# EAGLE design Watch V2 (EAGLE 9.5.2)
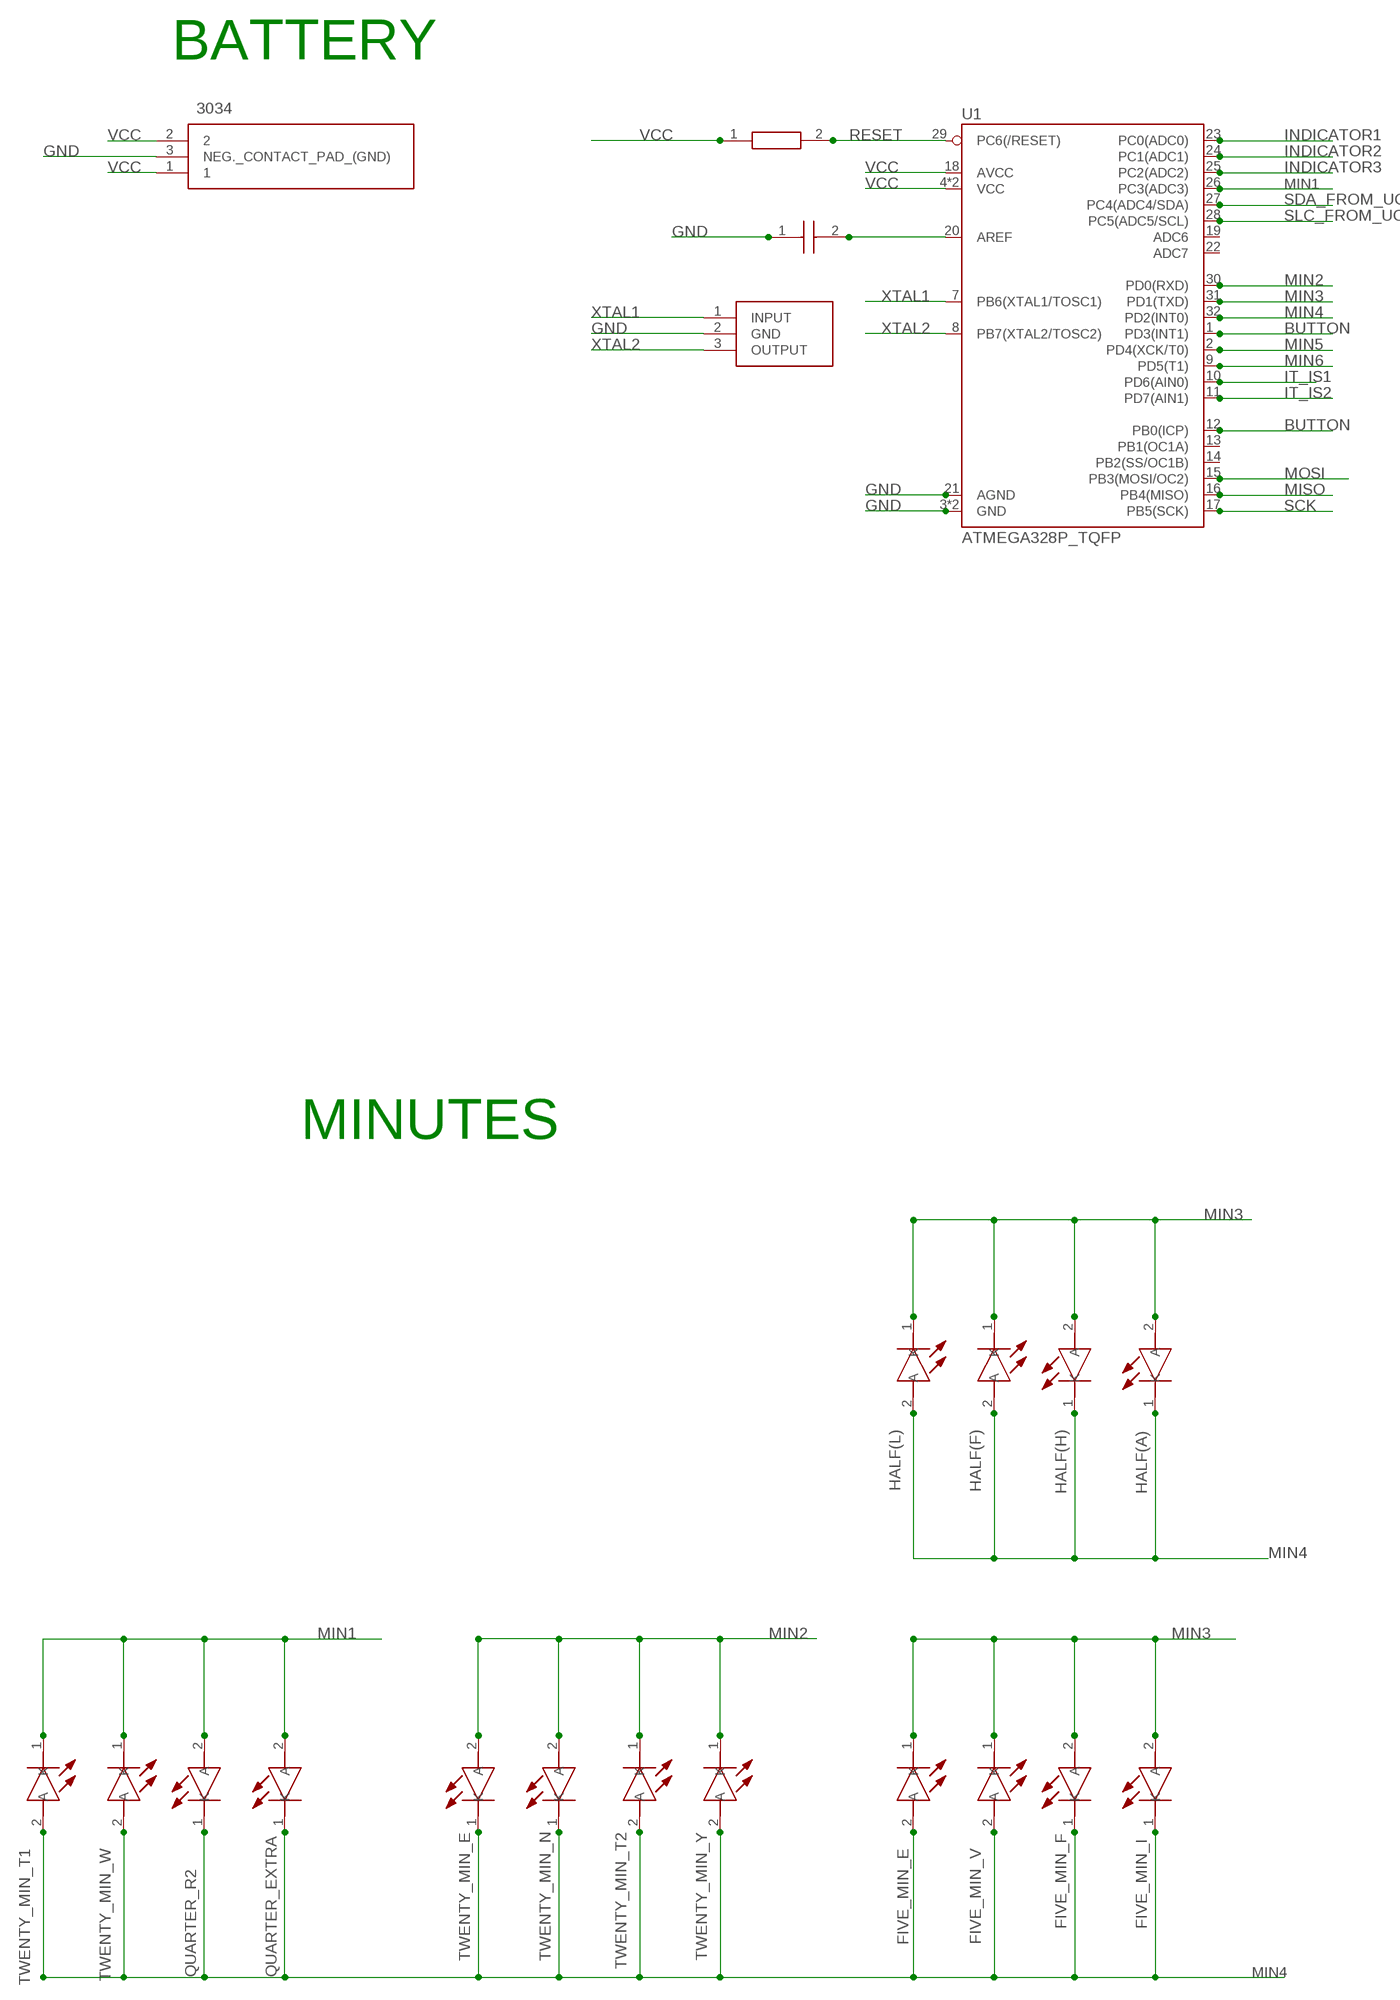
[diagram p0: schematic, sheet 1, part 1 of 3]
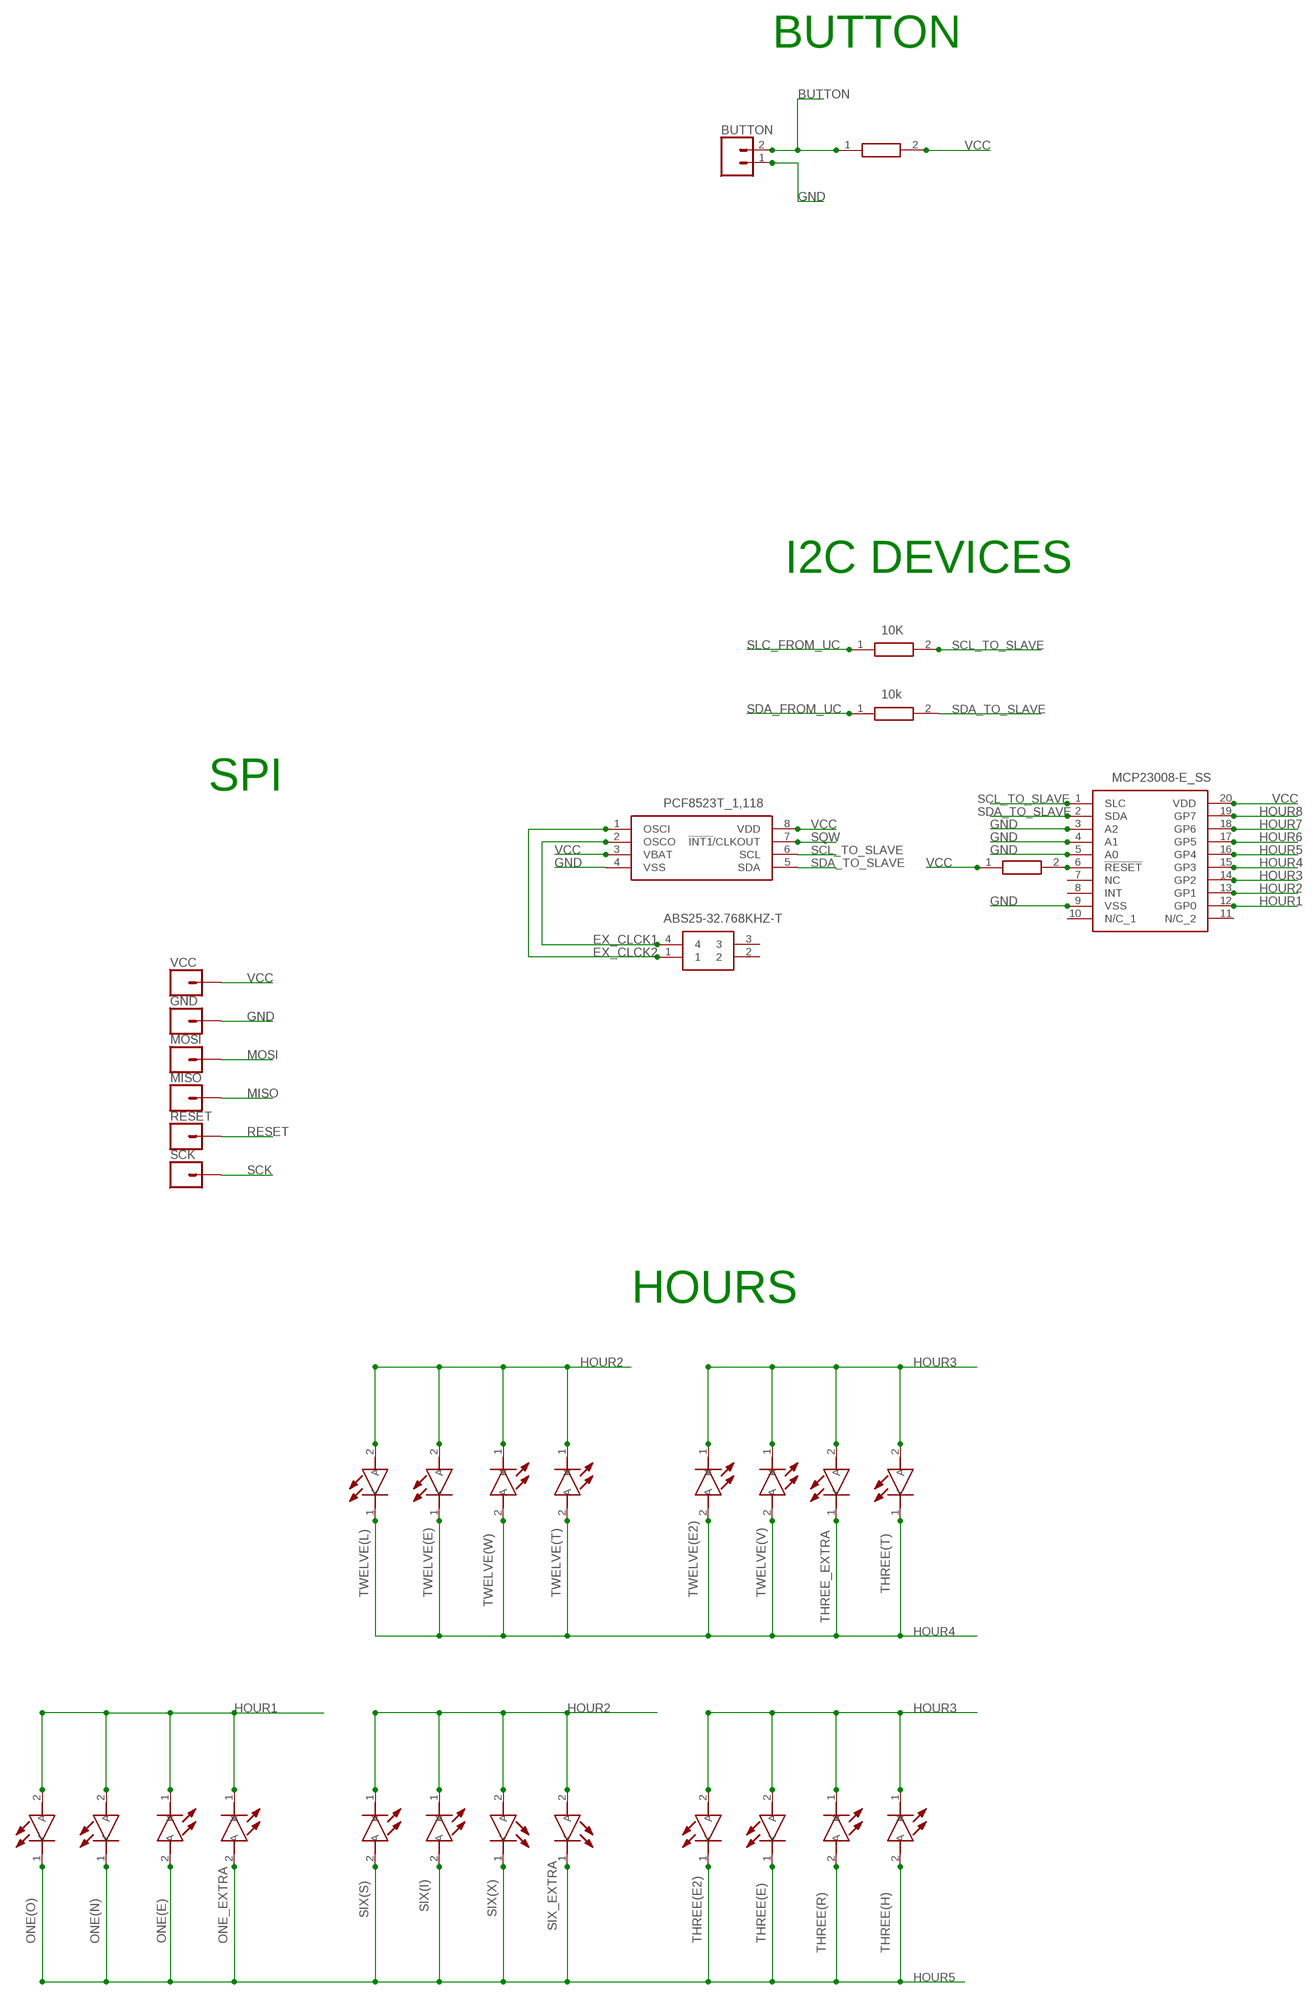
[diagram p1: schematic, sheet 1, part 2 of 3]
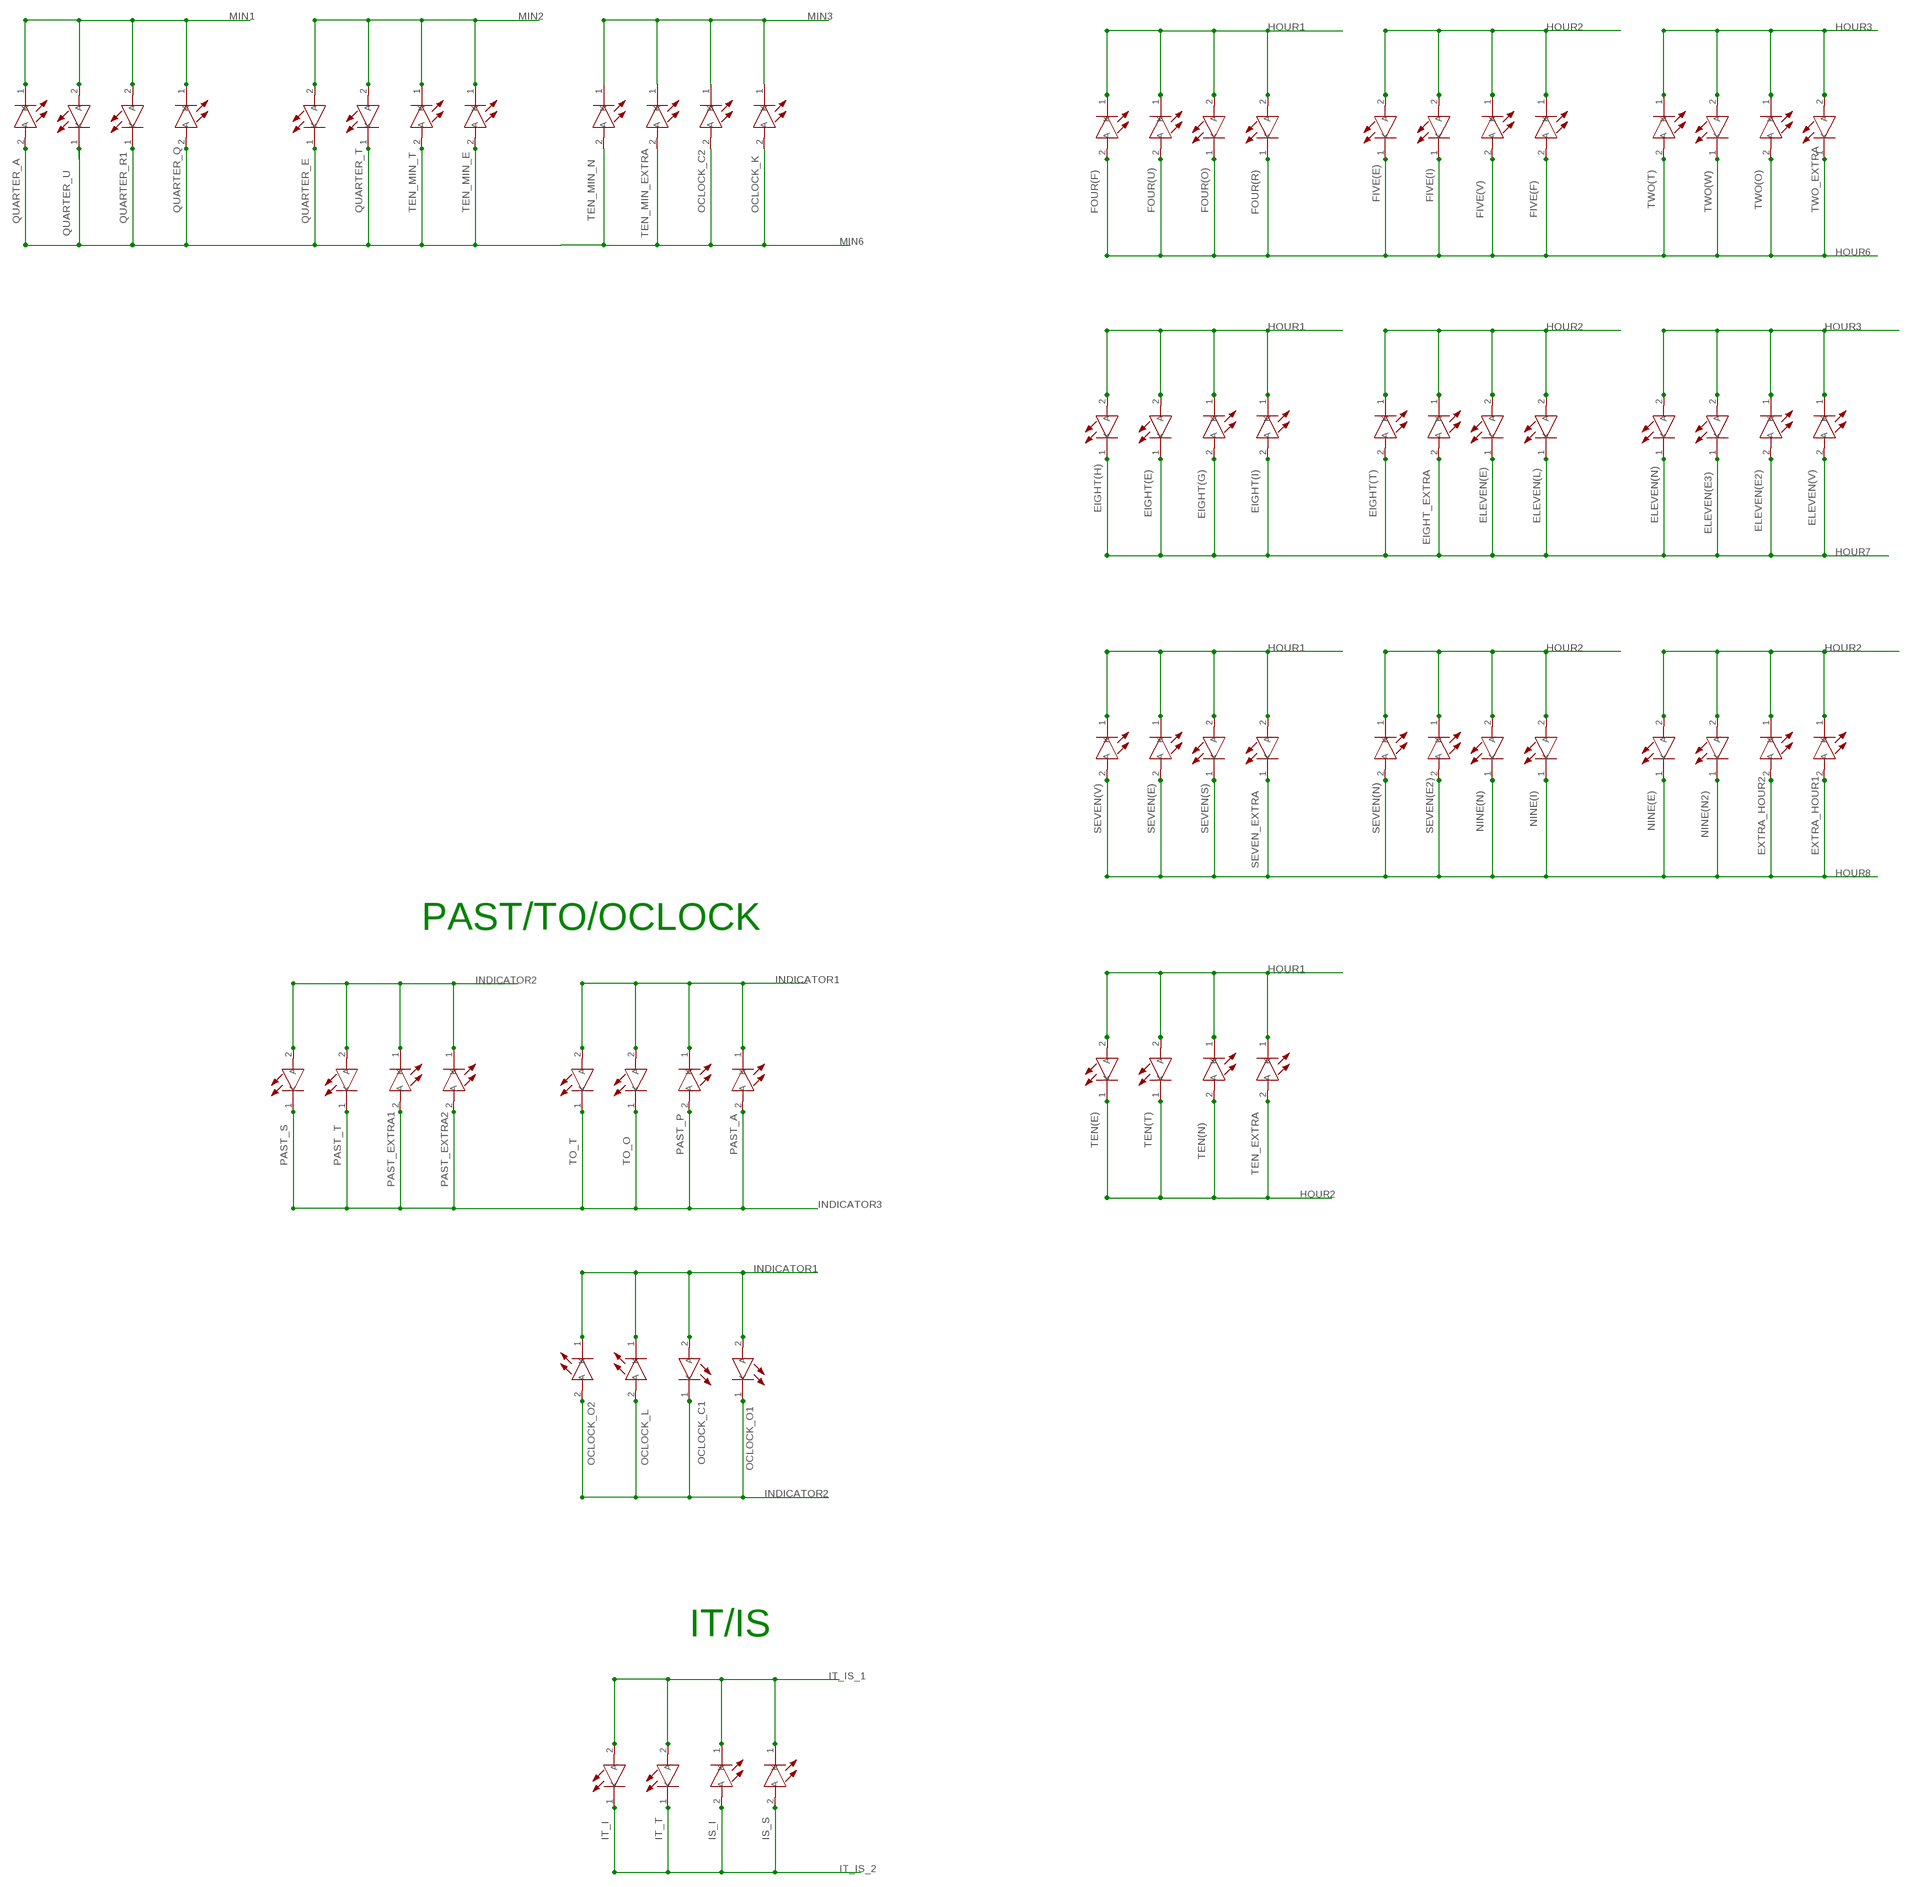
[diagram p2: schematic, sheet 1, part 3 of 3]

## Parts
10K  RC0402FR-0722RL  [RESC1005X40N]
BUTTON  CONN_02  [1X02]
C1  C0402C104Z4VAC  [CAPC1005X55N]
EIGHT(E)  APHHS1005CGCK  [LEDC1005X60N]
EIGHT(G)  APHHS1005CGCK  [LEDC1005X60N]
EIGHT(H)  APHHS1005CGCK  [LEDC1005X60N]
EIGHT(I)  APHHS1005CGCK  [LEDC1005X60N]
EIGHT(T)  APHHS1005CGCK  [LEDC1005X60N]
EIGHT_EXTRA  APHHS1005CGCK  [LEDC1005X60N]
ELEVEN(E2)  APHHS1005CGCK  [LEDC1005X60N]
ELEVEN(E3)  APHHS1005CGCK  [LEDC1005X60N]
ELEVEN(E)  APHHS1005CGCK  [LEDC1005X60N]
ELEVEN(L)  APHHS1005CGCK  [LEDC1005X60N]
ELEVEN(N)  APHHS1005CGCK  [LEDC1005X60N]
ELEVEN(V)  APHHS1005CGCK  [LEDC1005X60N]
EXTRA_HOUR1  APHHS1005CGCK  [LEDC1005X60N]
EXTRA_HOUR2  APHHS1005CGCK  [LEDC1005X60N]
FIVE(E)  APHHS1005CGCK  [LEDC1005X60N]
FIVE(F)  APHHS1005CGCK  [LEDC1005X60N]
FIVE(I)  APHHS1005CGCK  [LEDC1005X60N]
FIVE(V)  APHHS1005CGCK  [LEDC1005X60N]
FIVE_MIN_E  APHHS1005CGCK  [LEDC1005X60N]
FIVE_MIN_F  APHHS1005CGCK  [LEDC1005X60N]
FIVE_MIN_I  APHHS1005CGCK  [LEDC1005X60N]
FIVE_MIN_V  APHHS1005CGCK  [LEDC1005X60N]
FOUR(F)  APHHS1005CGCK  [LEDC1005X60N]
FOUR(O)  APHHS1005CGCK  [LEDC1005X60N]
FOUR(R)  APHHS1005CGCK  [LEDC1005X60N]
FOUR(U)  APHHS1005CGCK  [LEDC1005X60N]
GND  CONN_01  [1X01]
HALF(A)  APHHS1005CGCK  [LEDC1005X60N]
HALF(F)  APHHS1005CGCK  [LEDC1005X60N]
HALF(H)  APHHS1005CGCK  [LEDC1005X60N]
HALF(L)  APHHS1005CGCK  [LEDC1005X60N]
IC1  MCP23008-E_SS  [SOP65P780X200-20N]
IC2  CSTNE16M0VH3C000R0  [CSTNE16M0VH3C000R0]
IC3  PCF8523T_1,118  [SOIC127P600X175-8N]
IS_I  APHHS1005CGCK  [LEDC1005X60N]
IS_S  APHHS1005CGCK  [LEDC1005X60N]
IT_I  APHHS1005CGCK  [LEDC1005X60N]
IT_T  APHHS1005CGCK  [LEDC1005X60N]
MISO  CONN_01  [1X01]
MOSI  CONN_01  [1X01]
NINE(E)  APHHS1005CGCK  [LEDC1005X60N]
NINE(I)  APHHS1005CGCK  [LEDC1005X60N]
NINE(N2)  APHHS1005CGCK  [LEDC1005X60N]
NINE(N)  APHHS1005CGCK  [LEDC1005X60N]
OCLOCK_C1  APHHS1005CGCK  [LEDC1005X60N]
OCLOCK_C2  APHHS1005CGCK  [LEDC1005X60N]
OCLOCK_K  APHHS1005CGCK  [LEDC1005X60N]
OCLOCK_L  APHHS1005CGCK  [LEDC1005X60N]
OCLOCK_O1  APHHS1005CGCK  [LEDC1005X60N]
OCLOCK_O2  APHHS1005CGCK  [LEDC1005X60N]
ONE(E)  APHHS1005CGCK  [LEDC1005X60N]
ONE(N)  APHHS1005CGCK  [LEDC1005X60N]
ONE(O)  APHHS1005CGCK  [LEDC1005X60N]
ONE_EXTRA  APHHS1005CGCK  [LEDC1005X60N]
PAST_A  APHHS1005CGCK  [LEDC1005X60N]
PAST_EXTRA1  48ohm  APHHS1005CGCK  [LEDC1005X60N]
PAST_EXTRA2  APHHS1005CGCK  [LEDC1005X60N]
PAST_P  48ohm  APHHS1005CGCK  [LEDC1005X60N]
PAST_S  APHHS1005CGCK  [LEDC1005X60N]
PAST_T  APHHS1005CGCK  [LEDC1005X60N]
QUARTER_A  APHHS1005CGCK  [LEDC1005X60N]
QUARTER_E  APHHS1005CGCK  [LEDC1005X60N]
QUARTER_EXTRA  APHHS1005CGCK  [LEDC1005X60N]
QUARTER_Q  APHHS1005CGCK  [LEDC1005X60N]
QUARTER_R1  APHHS1005CGCK  [LEDC1005X60N]
QUARTER_R2  APHHS1005CGCK  [LEDC1005X60N]
QUARTER_T  APHHS1005CGCK  [LEDC1005X60N]
QUARTER_U  APHHS1005CGCK  [LEDC1005X60N]
RED1  RC0402FR-0722RL  [RESC1005X40N]
RED2  RC0402FR-0722RL  [RESC1005X40N]
RED5  RC0402FR-0722RL  [RESC1005X40N]
RED7  10k  RC0402FR-0722RL  [RESC1005X40N]
RESET  CONN_01  [1X01]
SCK  CONN_01  [1X01]
SEVEN(E2)  APHHS1005CGCK  [LEDC1005X60N]
SEVEN(E)  APHHS1005CGCK  [LEDC1005X60N]
SEVEN(N)  APHHS1005CGCK  [LEDC1005X60N]
SEVEN(S)  APHHS1005CGCK  [LEDC1005X60N]
SEVEN(V)  APHHS1005CGCK  [LEDC1005X60N]
SEVEN_EXTRA  APHHS1005CGCK  [LEDC1005X60N]
SIX(I)  APHHS1005CGCK  [LEDC1005X60N]
SIX(S)  APHHS1005CGCK  [LEDC1005X60N]
SIX(X)  APHHS1005CGCK  [LEDC1005X60N]
SIX_EXTRA  APHHS1005CGCK  [LEDC1005X60N]
TEN(E)  APHHS1005CGCK  [LEDC1005X60N]
TEN(N)  APHHS1005CGCK  [LEDC1005X60N]
TEN(T)  APHHS1005CGCK  [LEDC1005X60N]
TEN_EXTRA  APHHS1005CGCK  [LEDC1005X60N]
TEN_MIN_E  APHHS1005CGCK  [LEDC1005X60N]
TEN_MIN_EXTRA  APHHS1005CGCK  [LEDC1005X60N]
TEN_MIN_N  APHHS1005CGCK  [LEDC1005X60N]
TEN_MIN_T  APHHS1005CGCK  [LEDC1005X60N]
THREE(E2)  APHHS1005CGCK  [LEDC1005X60N]
THREE(E)  APHHS1005CGCK  [LEDC1005X60N]
THREE(H)  APHHS1005CGCK  [LEDC1005X60N]
THREE(R)  APHHS1005CGCK  [LEDC1005X60N]
THREE(T)  APHHS1005CGCK  [LEDC1005X60N]
THREE_EXTRA  APHHS1005CGCK  [LEDC1005X60N]
TO_O  APHHS1005CGCK  [LEDC1005X60N]
TO_T  APHHS1005CGCK  [LEDC1005X60N]
TWELVE(E2)  APHHS1005CGCK  [LEDC1005X60N]
TWELVE(E)  APHHS1005CGCK  [LEDC1005X60N]
TWELVE(L)  APHHS1005CGCK  [LEDC1005X60N]
TWELVE(T)  APHHS1005CGCK  [LEDC1005X60N]
TWELVE(V)  APHHS1005CGCK  [LEDC1005X60N]
TWELVE(W)  APHHS1005CGCK  [LEDC1005X60N]
TWENTY_MIN_E  APHHS1005CGCK  [LEDC1005X60N]
TWENTY_MIN_N  APHHS1005CGCK  [LEDC1005X60N]
TWENTY_MIN_T1  APHHS1005CGCK  [LEDC1005X60N]
TWENTY_MIN_T2  APHHS1005CGCK  [LEDC1005X60N]
TWENTY_MIN_W  APHHS1005CGCK  [LEDC1005X60N]
TWENTY_MIN_Y  APHHS1005CGCK  [LEDC1005X60N]
TWO(O)  APHHS1005CGCK  [LEDC1005X60N]
TWO(T)  APHHS1005CGCK  [LEDC1005X60N]
TWO(W)  APHHS1005CGCK  [LEDC1005X60N]
TWO_EXTRA  APHHS1005CGCK  [LEDC1005X60N]
U1  ATMEGA328P_TQFP  [TQFP32-08]
U2  3034  [3034]
VCC  CONN_01  [1X01]
Y1  ABS25-32.768KHZ-T  [ABS2532768KHZT]

## Nets
BUTTON: BUTTON.2 RED1.1 U1.1(PD3(INT1)) U1.12(PB0(ICP))
EX_CLCK1: IC3.2(OSCO) Y1.4
EX_CLCK2: IC3.1(OSCI) Y1.1
GND: BUTTON.1 C1.1 GND.1 IC1.3(A2) IC1.4(A1) IC1.5(A0) IC1.9(VSS) IC2.2(GND) IC3.4(VSS) U1.3(GND) U1.5(GND) U1.21(AGND) U2.3(NEG._CONTACT_PAD_(GND))
HOUR1: EIGHT(E).2(A) EIGHT(G).1(K) EIGHT(H).2(A) EIGHT(I).1(K) FOUR(F).1(K) FOUR(O).2(A) FOUR(R).2(A) FOUR(U).1(K) IC1.12(GP0) ONE(E).1(K) ONE(N).2(A) ONE(O).2(A) ONE_EXTRA.1(K) SEVEN(E).1(K) SEVEN(S).2(A) SEVEN(V).1(K) SEVEN_EXTRA.2(A) TEN(E).2(A) TEN(N).1(K) TEN(T).2(A) TEN_EXTRA.1(K)
HOUR2: EIGHT(T).1(K) EIGHT_EXTRA.1(K) ELEVEN(E).2(A) ELEVEN(L).2(A) EXTRA_HOUR1.1(K) EXTRA_HOUR2.1(K) FIVE(E).2(A) FIVE(F).1(K) FIVE(I).2(A) FIVE(V).1(K) IC1.13(GP1) NINE(E).2(A) NINE(I).2(A) NINE(N2).2(A) NINE(N).2(A) SEVEN(E2).1(K) SEVEN(N).1(K) SIX(I).1(K) SIX(S).1(K) SIX(X).2(A) SIX_EXTRA.2(A) TEN(E).1(K) TEN(N).2(A) TEN(T).1(K) TEN_EXTRA.2(A) TWELVE(E).2(A) TWELVE(L).2(A) TWELVE(T).1(K) TWELVE(W).1(K)
HOUR3: ELEVEN(E2).1(K) ELEVEN(E3).2(A) ELEVEN(N).2(A) ELEVEN(V).1(K) IC1.14(GP2) THREE(E2).2(A) THREE(E).2(A) THREE(H).1(K) THREE(R).1(K) THREE(T).2(A) THREE_EXTRA.2(A) TWELVE(E2).1(K) TWELVE(V).1(K) TWO(O).1(K) TWO(T).1(K) TWO(W).2(A) TWO_EXTRA.2(A)
HOUR4: IC1.15(GP3) THREE(T).1(K) THREE_EXTRA.1(K) TWELVE(E2).2(A) TWELVE(E).1(K) TWELVE(L).1(K) TWELVE(T).2(A) TWELVE(V).2(A) TWELVE(W).2(A)
HOUR5: IC1.16(GP4) ONE(E).2(A) ONE(N).1(K) ONE(O).1(K) ONE_EXTRA.2(A) SIX(I).2(A) SIX(S).2(A) SIX(X).1(K) SIX_EXTRA.1(K) THREE(E2).1(K) THREE(E).1(K) THREE(H).2(A) THREE(R).2(A)
HOUR6: FIVE(E).1(K) FIVE(F).2(A) FIVE(I).1(K) FIVE(V).2(A) FOUR(F).2(A) FOUR(O).1(K) FOUR(R).1(K) FOUR(U).2(A) IC1.17(GP5) TWO(O).2(A) TWO(T).2(A) TWO(W).1(K) TWO_EXTRA.1(K)
HOUR7: EIGHT(E).1(K) EIGHT(G).2(A) EIGHT(H).1(K) EIGHT(I).2(A) EIGHT(T).2(A) EIGHT_EXTRA.2(A) ELEVEN(E2).2(A) ELEVEN(E3).1(K) ELEVEN(E).1(K) ELEVEN(L).1(K) ELEVEN(N).1(K) ELEVEN(V).2(A) IC1.18(GP6)
HOUR8: EXTRA_HOUR1.2(A) EXTRA_HOUR2.2(A) IC1.19(GP7) NINE(E).1(K) NINE(I).1(K) NINE(N2).1(K) NINE(N).1(K) SEVEN(E2).2(A) SEVEN(E).2(A) SEVEN(N).2(A) SEVEN(S).1(K) SEVEN(V).2(A) SEVEN_EXTRA.1(K)
INDICATOR1: OCLOCK_C1.2(A) OCLOCK_L.1(K) OCLOCK_O1.2(A) OCLOCK_O2.1(K) PAST_A.1(K) PAST_P.1(K) TO_O.2(A) TO_T.2(A) U1.23(PC0(ADC0))
INDICATOR2: OCLOCK_C1.1(K) OCLOCK_L.2(A) OCLOCK_O1.1(K) OCLOCK_O2.2(A) PAST_EXTRA1.1(K) PAST_EXTRA2.1(K) PAST_S.2(A) PAST_T.2(A) U1.24(PC1(ADC1))
INDICATOR3: PAST_A.2(A) PAST_EXTRA1.2(A) PAST_EXTRA2.2(A) PAST_P.2(A) PAST_S.1(K) PAST_T.1(K) TO_O.1(K) TO_T.1(K) U1.25(PC2(ADC2))
IT_IS1: U1.10(PD6(AIN0))
IT_IS2: U1.11(PD7(AIN1))
IT_IS_1: IS_I.1(K) IS_S.1(K) IT_I.2(A) IT_T.2(A)
IT_IS_2: IS_I.2(A) IS_S.2(A) IT_I.1(K) IT_T.1(K)
MIN1: QUARTER_A.1(K) QUARTER_EXTRA.2(A) QUARTER_Q.1(K) QUARTER_R1.2(A) QUARTER_R2.2(A) QUARTER_U.2(A) TWENTY_MIN_T1.1(K) TWENTY_MIN_W.1(K) U1.26(PC3(ADC3))
MIN2: QUARTER_E.2(A) QUARTER_T.2(A) TEN_MIN_E.1(K) TEN_MIN_T.1(K) TWENTY_MIN_E.2(A) TWENTY_MIN_N.2(A) TWENTY_MIN_T2.1(K) TWENTY_MIN_Y.1(K) U1.30(PD0(RXD))
MIN3: FIVE_MIN_E.1(K) FIVE_MIN_F.2(A) FIVE_MIN_I.2(A) FIVE_MIN_V.1(K) HALF(A).2(A) HALF(F).1(K) HALF(H).2(A) HALF(L).1(K) OCLOCK_C2.1(K) OCLOCK_K.1(K) TEN_MIN_EXTRA.1(K) TEN_MIN_N.1(K) U1.31(PD1(TXD))
MIN4: FIVE_MIN_E.2(A) FIVE_MIN_F.1(K) FIVE_MIN_I.1(K) FIVE_MIN_V.2(A) HALF(A).1(K) HALF(F).2(A) HALF(H).1(K) HALF(L).2(A) QUARTER_EXTRA.1(K) QUARTER_R2.1(K) TWENTY_MIN_E.1(K) TWENTY_MIN_N.1(K) TWENTY_MIN_T1.2(A) TWENTY_MIN_T2.2(A) TWENTY_MIN_W.2(A) TWENTY_MIN_Y.2(A) U1.32(PD2(INT0))
MIN5: U1.2(PD4(XCK/T0))
MIN6: OCLOCK_C2.2(A) OCLOCK_K.2(A) QUARTER_A.2(A) QUARTER_E.1(K) QUARTER_Q.2(A) QUARTER_R1.1(K) QUARTER_T.1(K) QUARTER_U.1(K) TEN_MIN_E.2(A) TEN_MIN_EXTRA.2(A) TEN_MIN_N.2(A) TEN_MIN_T.2(A) U1.9(PD5(T1))
MISO: MISO.1 U1.16(PB4(MISO))
MOSI: MOSI.1 U1.15(PB3(MOSI/OC2))
N$1: IC1.6(!RESET) RED2.2
N$42: C1.2 U1.20(AREF)
RESET: RED5.2 RESET.1 U1.29(PC6(/RESET))
SCK: SCK.1 U1.17(PB5(SCK))
SCL_TO_SLAVE: 10K.2 IC1.1(SLC) IC3.6(SCL)
SDA_FROM_UC: RED7.1 U1.27(PC4(ADC4/SDA))
SDA_TO_SLAVE: IC1.2(SDA) IC3.5(SDA) RED7.2
SLC_FROM_UC: 10K.1 U1.28(PC5(ADC5/SCL))
SQW: IC3.7(!INT1!/CLKOUT)
VCC: IC1.20(VDD) IC3.3(VBAT) IC3.8(VDD) RED1.2 RED2.1 RED5.1 U1.4(VCC) U1.6(VCC) U1.18(AVCC) U2.1 U2.2 VCC.1
XTAL1: IC2.1(INPUT) U1.7(PB6(XTAL1/TOSC1))
XTAL2: IC2.3(OUTPUT) U1.8(PB7(XTAL2/TOSC2))
Unconnected: IC1.7(NC) IC1.8(INT) IC1.10(N/C_1) IC1.11(N/C_2) U1.13(PB1(OC1A)) U1.14(PB2(SS/OC1B)) U1.19(ADC6) U1.22(ADC7) Y1.2 Y1.3

## Notes on the sheet
- BUTTON
- BATTERY
- I2C DEVICES
- SPI
- HOURS
- MINUTES
- PAST/TO/OCLOCK
- IT/IS

## Library data of the parts
10K RED1 RED2 RED5 RED7 = SamacSys_Parts:RC0402FR-0722RL: YAGEO (PHYCOMP) - RC0402FR-0722RL - RES, THICK FILM, 22R, 1%, 0.063W, 0402 Source: Datasheet <https://componentsearchengine.com/Datasheets/1/RC0402FR-0722RL.pdf>; DESCRIPTION: YAGEO (PHYCOMP) - RC0402FR-0722RL - RES, THICK FILM, 22R, 1%, 0.063W, 0402; HEIGHT: 0.4mm; MANUFACTURER_NAME: YAGEO (PHYCOMP); MANUFACTURER_PART_NUMBER: RC0402FR-0722RL; MOUSER_PART_NUMBER: 603-RC0402FR-0722RL; MOUSER_PRICE-STOCK: https://www.mouser.com/Search/Refine.aspx?Keyword=603-RC0402FR-0722RL
BUTTON = SparkFun-Connectors:CONN_02: Multi connection point. Often used as Generic Header-pin footprint for 0.1 inch spaced/style header connections On any of the 0.1 inch spaced packages, you can populate with these: Break Away Headers - Straight <https://www.sparkfun.com/products/116> (PRT-00116) Break Away Male Headers - Right Angle <https://www.sparkfun.com/products/553> (PRT-00553) Female Headers <https://www.sparkfun.com/products/115> (PRT-00115) Break Away Headers - Machine Pin <https://www.sparkfun.com/products/117> (PRT-00117) Break Away Female Headers - Swiss Machine Pin <https://www.sparkfun.com/products/743> (PRT-00743) For SCREWTERMINALS and SPRING TERMINALS visit here: Screw Terimnals on SparkFun.com <https://www.sparkfun.com/search/results?term=Screw+Terminals> (5mm/3.5mm/2.54mm spacing) This device is also useful as a general connection point to wire up your design to another part of your project. Our various solder wires solder well into these plated through hole pads. Hook-Up Wire - Assortment (Stranded, 22 AWG) <https://www.sparkfun.com/products/11375> (PRT-11375) Hook-Up Wire - Assortment (Solid Core, 22 AWG) <https://www.sparkfun.com/products/11367> (PRT-11367) View the entire wire category on our website here <https://www.sparkfun.com/categories/141> Special notes: Molex polarized connector foot print use with: PRT-08233 with associated crimp pins and housings. 2.54_SCREWTERM for use with PRT-10571. 3.5mm Screw Terminal footprints for PRT-08084 5mm Screw Terminal footprints for use with PRT-08432
C1 = C0402C104Z4VAC:C0402C104Z4VAC: Multilayer Ceramic Capacitors MLCC - SMD/SMT 16volts 0.1uF Y5V Source: Datasheet; DESCRIPTION: Multilayer Ceramic Capacitors MLCC - SMD/SMT 16volts 0.1uF Y5V; HEIGHT: 0.55mm; MANUFACTURER_NAME: Kemet; MANUFACTURER_PART_NUMBER: C0402C104Z4VAC; MOUSER_PART_NUMBER: 80-C0402C104Z4VAC; MOUSER_PRICE-STOCK: https://www.mouser.co.uk/ProductDetail/KEMET/C0402C104Z4VAC?qs=sykUljcfnH0lxjRVltIu6A%3D%3D
EIGHT(E) EIGHT(G) EIGHT(H) EIGHT(I) EIGHT(T) EIGHT_EXTRA ELEVEN(E2) ELEVEN(E3) ELEVEN(E) ELEVEN(L) ELEVEN(N) ELEVEN(V) EXTRA_HOUR1 EXTRA_HOUR2 FIVE(E) FIVE(F) FIVE(I) FIVE(V) FIVE_MIN_E FIVE_MIN_F FIVE_MIN_I FIVE_MIN_V FOUR(F) FOUR(O) FOUR(R) FOUR(U) HALF(A) HALF(F) HALF(H) HALF(L) IS_I IS_S IT_I IT_T NINE(E) NINE(I) NINE(N2) NINE(N) OCLOCK_C1 OCLOCK_C2 OCLOCK_K OCLOCK_L OCLOCK_O1 OCLOCK_O2 ONE(E) ONE(N) ONE(O) ONE_EXTRA PAST_A PAST_EXTRA1 PAST_EXTRA2 PAST_P PAST_S PAST_T QUARTER_A QUARTER_E QUARTER_EXTRA QUARTER_Q QUARTER_R1 QUARTER_R2 QUARTER_T QUARTER_U SEVEN(E2) SEVEN(E) SEVEN(N) SEVEN(S) SEVEN(V) SEVEN_EXTRA SIX(I) SIX(S) SIX(X) SIX_EXTRA TEN(E) TEN(N) TEN(T) TEN_EXTRA TEN_MIN_E TEN_MIN_EXTRA TEN_MIN_N TEN_MIN_T THREE(E2) THREE(E) THREE(H) THREE(R) THREE(T) THREE_EXTRA TO_O TO_T TWELVE(E2) TWELVE(E) TWELVE(L) TWELVE(T) TWELVE(V) TWELVE(W) TWENTY_MIN_E TWENTY_MIN_N TWENTY_MIN_T1 TWENTY_MIN_T2 TWENTY_MIN_W TWENTY_MIN_Y TWO(O) TWO(T) TWO(W) TWO_EXTRA = SamacSys_Parts:APHHS1005CGCK: Kingbright APHHS1005CGCK, APHHS1005 Series Green LED, 570 nm, 1005 (0402) Clear, Rectangle Lens SMD Package Source: Datasheet <https://componentsearchengine.com/Datasheets/1/APHHS1005CGCK.pdf>; DESCRIPTION: Kingbright APHHS1005CGCK, APHHS1005 Series Green LED, 570 nm, 1005 (0402) Clear, Rectangle Lens SMD Package; HEIGHT: 0.6mm; MANUFACTURER_NAME: Kingbright; MANUFACTURER_PART_NUMBER: APHHS1005CGCK; MOUSER_PART_NUMBER: 604-APHHS1005CGCK; MOUSER_PRICE-STOCK: https://www.mouser.com/Search/Refine.aspx?Keyword=604-APHHS1005CGCK
GND MISO MOSI RESET SCK VCC = SparkFun-Connectors:CONN_01: Single connection point. Often used as Generic Header-pin footprint for 0.1 inch spaced/style header connections On any of the 0.1 inch spaced packages, you can populate with these: Break Away Headers - Straight <https://www.sparkfun.com/products/116> (PRT-00116) Break Away Male Headers - Right Angle <https://www.sparkfun.com/products/553> (PRT-00553) Female Headers <https://www.sparkfun.com/products/115> (PRT-00115) Break Away Headers - Machine Pin <https://www.sparkfun.com/products/117> (PRT-00117) Break Away Female Headers - Swiss Machine Pin <https://www.sparkfun.com/products/743> (PRT-00743) This device is also useful as a general connection point to wire up your design to another part of your project. Our various solder wires solder well into these plated through hole pads. Hook-Up Wire - Assortment (Stranded, 22 AWG) <https://www.sparkfun.com/products/11375> (PRT-11375) Hook-Up Wire - Assortment (Solid Core, 22 AWG) <https://www.sparkfun.com/products/11367> (PRT-11367) View the entire wire category on our website here <https://www.sparkfun.com/categories/141> Special notes: SMTSO-256-ET is a "flush mount" nut for a 4-40 screw. We mostly use this on specialty testbeds; it is a nice way to connect hardware to your PCB at an adjustable hieght. Also note, the SNAP packages are for using a snappable style connector. We sell a baggie of snaps and they are also used on two LilyPad designs: Snap Assortment - 30 pack (male and female) <https://www.sparkfun.com/products/11347> (DEV-11347) LilyPad Arduino SimpleSnap <https://www.sparkfun.com/products/10941> (DEV-10941) LilyPad SimpleSnap Protoboard <https://www.sparkfun.com/products/10940> (DEV-10940)
IC1 = MCP23008-E_SS:MCP23008-E_SS: 8-Bit I/O Port Expander I2C 1.7M SSOP20 Microchip MCP23008-E/SS, 8-channel 8bit I/O Expander 1.7MHz, I2C, 20-Pin SSOP Source: Datasheet; DESCRIPTION: 8-Bit I/O Port Expander I2C 1.7M SSOP20 Microchip MCP23008-E/SS, 8-channel 8bit I/O Expander 1.7MHz, I2C, 20-Pin SSOP; HEIGHT: 2mm; MANUFACTURER_NAME: Microchip; MANUFACTURER_PART_NUMBER: MCP23008-E/SS; MOUSER_PART_NUMBER: 579-MCP23008-E/SS; MOUSER_PRICE-STOCK: https://www.mouser.co.uk/ProductDetail/Microchip-Technology/MCP23008-E-SS?qs=Sez7gRs8XSU%2FXF8up%2FiqvA%3D%3D
IC2 = CSTNE16M0VH3C000R0:CSTNE16M0VH3C000R0: Resonators 16.0000MHz 15pF SMD CHP Rsntr 0.07% AUTO Source: Datasheet <https://www.murata.com/en-eu/products/productdata/8801162264606/SPEC-CSTNE16M0VH3C000R0.pdf?1519875007000>; DESCRIPTION: Resonators 16.0000MHz 15pF SMD CHP Rsntr 0.07% AUTO; HEIGHT: 1mm; MANUFACTURER_NAME: Murata Electronics; MANUFACTURER_PART_NUMBER: CSTNE16M0VH3C000R0; MOUSER_PART_NUMBER: 81-CSTNE16M0VH3C000R; MOUSER_PRICE-STOCK: https://www.mouser.co.uk/ProductDetail/Murata-Electronics/CSTNE16M0VH3C000R0?qs=y6ZabgHbY%252BxKpaBi77VCSg%3D%3D
IC3 = PCF8523T_1_118:PCF8523T_1,118: NXP - PCF8523T/1,118 - REAL TIME CLOCK/CALENDAR, I2C, SOIC-8 Source: Datasheet <http://www.nxp.com/docs/en/data-sheet/PCF8523.pdf>; DESCRIPTION: NXP - PCF8523T/1,118 - REAL TIME CLOCK/CALENDAR, I2C, SOIC-8; HEIGHT: 1.75mm; MANUFACTURER_NAME: NXP; MANUFACTURER_PART_NUMBER: PCF8523T/1,118; MOUSER_PART_NUMBER: 771-PCF8523T/1118; MOUSER_PRICE-STOCK: https://www.mouser.co.uk/ProductDetail/NXP-Semiconductors/PCF8523T-1118?qs=beN0Cyoe8YmmXShRMIPCwg%3D%3D
U1 = SparkFun-IC-Microcontroller:ATMEGA328P_TQFP: Popular 328P in QFP Storefront component: ATmega328 - TQFP <https://www.sparkfun.com/products/13448> (COM-13448) Datasheet <http://www.sparkfun.com/datasheets/Components/SMD/ATMega328.pdf> SparkFun Products SparkFun RedBoard - Programmed with Arduino <https://www.sparkfun.com/products/12757> (DEV-12757) Arduino Pro Mini 328 - 5V/16MHz <https://www.sparkfun.com/products/11113> (DEV-11113) Arduino Pro Mini 328 - 3.3V/8MHz <https://www.sparkfun.com/products/11114> (DEV-11114) SparkFun OpenLog <https://www.sparkfun.com/products/13712> (DEV-13712) SparkFun MicroView - OLED Arduino Module <https://www.sparkfun.com/products/12923> (DEV-12923) SparkFun Digital Sandbox <https://www.sparkfun.com/products/12651> (DEV-12651) SparkFun PicoBoard <https://www.sparkfun.com/products/11888> (WIG-11888) Arduino Fio <https://www.sparkfun.com/products/10116> (DEV-10116) LilyPad Arduino 328 Main Board <https://www.sparkfun.com/products/13342> (DEV-13342) SparkFun RedStick <https://www.sparkfun.com/products/13741> (DEV-13741) LilyPad MP3 <https://www.sparkfun.com/products/11013> (DEV-11013) LilyPad Arduino SimpleSnap <https://www.sparkfun.com/products/10941> (DEV-10941) SparkFun Stepoko <https://www.sparkfun.com/products/13899> (ROB-13899) SparkFun Geiger Counter <https://www.sparkfun.com/products/11345> (SEN-11345) SparkFun EL Sequencer <https://www.sparkfun.com/products/12781> (COM-12781) Arduino Pro 328 - 5V/16MHz <https://www.sparkfun.com/products/10915> (DEV-10915) CryptoCape <https://www.sparkfun.com/products/12773> (DEV-12773) SparkFun IR Thermometer Evaluation Board - MLX90614 <https://www.sparkfun.com/products/10740> (SEN-10740) SparkFun RedBot Mainboard <https://www.sparkfun.com/products/12097> (ROB-12097) Arduino Pro 328 - 3.3V/8MHz <https://www.sparkfun.com/products/10914> (DEV-10914) SparkFun Block for Intel® Edison - Arduino <https://www.sparkfun.com/products/13036> (DEV-13036) SparkFun Simon Says - Surface Mount Soldering Kit <https://www.sparkfun.com/products/10935> (KIT-10935) SparkFun 7-Segment Serial Display - Red <https://www.sparkfun.com/products/11441> (COM-11441) SparkFun 7-Segment Serial Display - White <https://www.sparkfun.com/products/11629> (COM-11629) SparkFun 7-Segment Serial Display - Yellow <https://www.sparkfun.com/products/11443> (COM-11443) SparkFun 7-Segment Serial Display - Kelly Green <https://www.sparkfun.com/products/11440> (COM-11440) SparkFun 7-Segment Serial Display - Blue <https://www.sparkfun.com/products/11442> (COM-11442) SparkFun OpenSegment Serial Display - 20mm (Blue) <https://www.sparkfun.com/products/11647> (COM-11647) SparkFun OpenSegment Serial Display - 20mm (Green) <https://www.sparkfun.com/products/11646> (COM-11646) SparkFun OpenSegment Serial Display - 20mm (White) <https://www.sparkfun.com/products/11648> (COM-11648) SparkFun OpenSegment Serial Display - 20mm (Red) <https://www.sparkfun.com/products/11644> (COM-11644) SparkFun OpenSegment Serial Display - 20mm (Yellow) <https://www.sparkfun.com/products/11645> (COM-11645) SparkFun OpenSegment Shield <https://www.sparkfun.com/products/13190> (DEV-13190); PROD_ID: IC-09069
U2 = cr2032_holder:3034: Coin Cell Battery Holders COIN CELL RETAINER Source: Datasheet <http://www.keyelco.com/product-pdf.cfm?p=798>; DESCRIPTION: Coin Cell Battery Holders COIN CELL RETAINER; HEIGHT: 4.06mm; MANUFACTURER_NAME: Keystone Electronics; MANUFACTURER_PART_NUMBER: 3034; MOUSER_PART_NUMBER: 534-3034; MOUSER_PRICE-STOCK: https://www.mouser.co.uk/ProductDetail/Keystone-Electronics/3034/?qs=LDXARy4xNQtGYr6pIAv90A%3D%3D
Y1 = ABS25-32.768KHZ-T:ABS25-32.768KHZ-T: ABRACON - ABS25-32.768KHZ-T - CRYSTAL, 32.768K, 12.5PF CL 8X2.5 SMD Source: Datasheet <http://www.abracon.com/Resonators/abs25.pdf>; DESCRIPTION: ABRACON - ABS25-32.768KHZ-T - CRYSTAL, 32.768K, 12.5PF CL 8X2.5 SMD; HEIGHT: 2mm; MANUFACTURER_NAME: ABRACON; MANUFACTURER_PART_NUMBER: ABS25-32.768KHZ-T; MOUSER_PART_NUMBER: 815-ABS25-32.768KHZT; MOUSER_PRICE-STOCK: https://www.mouser.co.uk/ProductDetail/ABRACON/ABS25-32768KHZ-T?qs=2xLVn2jvFusfExB%252ByZEnpA%3D%3D

## Board
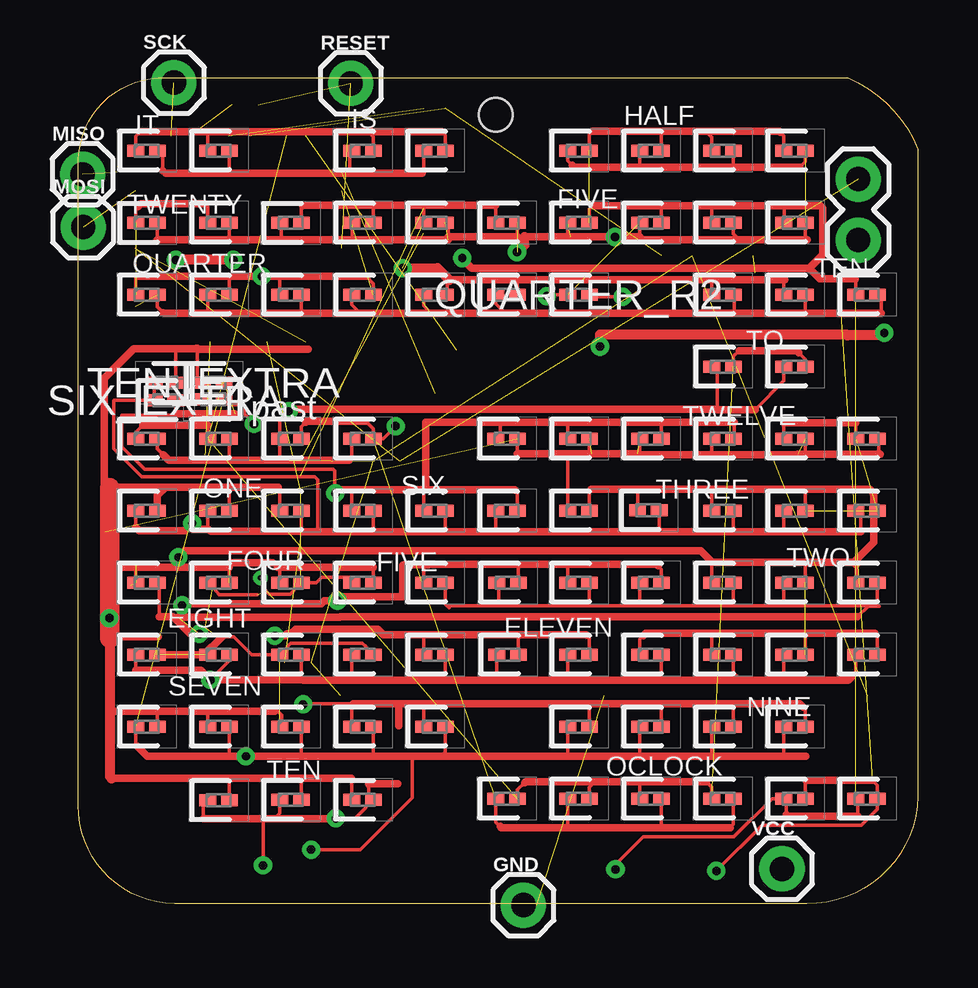
[diagram p3: board, top side]
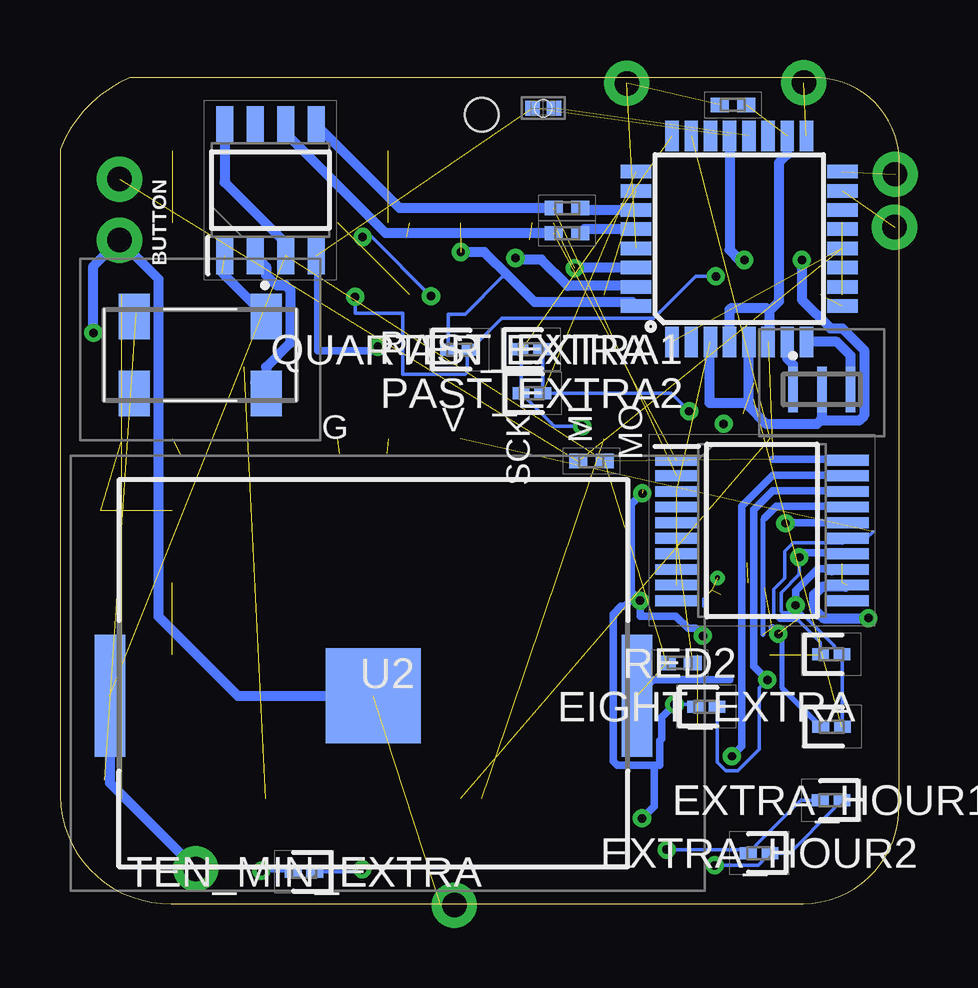
[diagram p4: board, bottom side, seen from below]

Size 34.97 x 34.41 mm. Coordinates in mm from the lower left corner, seen from the top.
Outline: 0,4.09 0,31.05 arc-90 3.64,34.41 32.07,34.41 arc-45 34.97,31.43 34.97,4.47 arc-90 30.34,0 4.01,0 arc-90 0,4.09
Copper layers (1*16): Top 0.035mm / dielectric 1.5mm / Bottom 0.035mm
Design rules "default": minimum track width 6mil, minimum drill 0.35mm, track to track 6mil, track to pad 6mil, pad to pad 6mil, via to via 6mil, smd to smd 6mil, copper to edge 40mil, drill to drill 6mil, minimum pad ring 10mil, minimum via ring 8mil, stop-mask expansion 4mil, vias tented up to drill 0mil, thermal gap 10mil
Holes 1.4 mm at 17.4,32.87

### Footprints (pad centres in the part's own frame; a part is rotated, then mirrored left to right if it is on the bottom)
RESC1005X40N = smd 0.75 x 0.6: 1 -0.55,0; 2 0.55,0
1X02 = drill 1.016 pad 1.88: 1 0,0; 2 2.54,0
CAPC1005X55N = smd 0.62 x 0.62: 1 -0.45,0; 2 0.45,0
LEDC1005X60N = smd 0.7 x 0.5: 1 -0.45,0; 2 0.45,0
1X01 = drill 1.016 pad 1.88: 1 0,0
SOP65P780X200-20N = smd 1.8 x 0.45: 1 -3.55,2.925; 2 -3.55,2.275; 3 -3.55,1.625; 4 -3.55,0.975; 5 -3.55,0.325; 6 -3.55,-0.325; 7 -3.55,-0.975; 8 -3.55,-1.625; 9 -3.55,-2.275; 10 -3.55,-2.925; 11 3.55,-2.925; 12 3.55,-2.275; 13 3.55,-1.625; 14 3.55,-0.975; 15 3.55,-0.325; 16 3.55,0.325; 17 3.55,0.975; 18 3.55,1.625; 19 3.55,2.275; 20 3.55,2.925
CSTNE16M0VH3C000R0 = smd 0.4 x 1.9: 1 -1.2,-0.425; 2 0,-0.425; 3 1.2,-0.425
SOIC127P600X175-8N = smd 1.55 x 0.7: 1 -2.725,1.905; 2 -2.725,0.635; 3 -2.725,-0.635; 4 -2.725,-1.905; 5 2.725,-1.905; 6 2.725,-0.635; 7 2.725,0.635; 8 2.725,1.905
TQFP32-08 = smd 1.27 x 0.559: 1 -4.293,2.8; 2 -4.293,2; 3 -4.293,1.2; 4 -4.293,0.4; 5 -4.293,-0.4; 6 -4.293,-1.2; 7 -4.293,-2; 8 -4.293,-2.8; 17 4.293,-2.8; 18 4.293,-2; 19 4.293,-1.2; 20 4.293,-0.4; 21 4.293,0.4; 22 4.293,1.2; 23 4.293,2; 24 4.293,2.8 | smd 0.559 x 1.27: 9 -2.8,-4.293; 10 -2,-4.293; 11 -1.2,-4.293; 12 -0.4,-4.293; 13 0.4,-4.293; 14 1.2,-4.293; 15 2,-4.293; 16 2.8,-4.293; 25 2.8,4.293; 26 2,4.293; 27 1.2,4.293; 28 0.4,4.293; 29 -0.4,4.293; 30 -1.2,4.293; 31 -2,4.293; 32 -2.8,4.293
3034 = smd 1.27 x 5.08: 1 10.985,0; 2 -10.985,0 | smd 3.96 x 3.96: 3 0,0
ABS2532768KHZT = smd 1.3 x 1.9: 1 -2.75,-1.05; 2 2.75,-1.05; 3 2.75,2.15; 4 -2.75,2.15

### Placement (x,y rotation side)
10K  13.84,27.93 180 bottom
BUTTON  32.49,27.65 90 top
C1  14.83,33.15 0 bottom
EIGHT(E)  2.84,10.38 0 top
EIGHT(G)  8.84,10.38 0 top
EIGHT(H)  11.84,10.38 0 top
EIGHT(I)  5.84,10.38 0 top
EIGHT(T)  14.84,10.38 0 top
EIGHT_EXTRA  8.04,8.21 0 bottom
ELEVEN(E2)  23.84,10.38 0 top
ELEVEN(E3)  29.84,10.38 0 top
ELEVEN(E)  17.88,10.38 0 top
ELEVEN(L)  20.84,10.38 0 top
ELEVEN(N)  32.84,10.38 0 top
ELEVEN(V)  26.84,10.38 0 top
EXTRA_HOUR1  2.84,4.31 180 bottom
EXTRA_HOUR2  5.84,2.11 180 bottom
FIVE(E)  23.84,13.38 0 top
FIVE(F)  14.84,13.38 0 top
FIVE(I)  17.88,13.38 0 top
FIVE(V)  20.84,13.38 0 top
FIVE_MIN_E  29.84,28.38 0 top
FIVE_MIN_F  20.84,28.38 0 top
FIVE_MIN_I  23.84,28.38 0 top
FIVE_MIN_V  26.84,28.38 0 top
FOUR(F)  2.84,13.38 0 top
FOUR(O)  5.84,13.38 0 top
FOUR(R)  11.84,13.38 0 top
FOUR(U)  8.84,13.38 0 top
GND  18.54,-0.06 0 top
HALF(A)  23.84,31.38 0 top
HALF(F)  29.84,31.38 0 top
HALF(H)  20.84,31.38 0 top
HALF(L)  26.84,31.38 0 top
IC1  5.72,15.55 0 bottom
IC2  3.23,21.85 0 bottom
IC3  26.2,29.73 90 bottom
IS_I  11.84,31.38 0 top
IS_S  14.84,31.38 0 top
IT_I  2.84,31.38 0 top
IT_T  5.84,31.38 0 top
MISO  0.17,30.39 0 top
MOSI  0.2,28.19 0 top
NINE(E)  29.84,7.38 0 top
NINE(I)  23.84,7.38 0 top
NINE(N2)  26.84,7.38 0 top
NINE(N)  20.84,7.38 0 top
OCLOCK_C1  20.84,4.38 0 top
OCLOCK_C2  29.84,4.38 0 top
OCLOCK_K  32.84,4.38 0 top
OCLOCK_L  23.84,4.38 0 top
OCLOCK_O1  17.84,4.38 0 top
OCLOCK_O2  26.84,4.38 0 top
ONE(E)  8.84,16.38 0 top
ONE(N)  5.84,16.38 0 top
ONE(O)  2.84,16.38 0 top
ONE_EXTRA  3.61,21.7 180 top
PAST_A  5.84,19.38 0 top
PAST_EXTRA1  15.35,23.1 0 bottom
PAST_EXTRA2  15.31,21.27 0 bottom
PAST_P  2.84,19.38 0 top
PAST_S  8.84,19.38 0 top
PAST_T  11.84,19.38 0 top
QUARTER_A  8.84,25.38 0 top
QUARTER_E  17.84,25.38 0 top
QUARTER_EXTRA  18.33,23.08 0 bottom
QUARTER_Q  2.84,25.38 0 top
QUARTER_R1  11.84,25.38 0 top
QUARTER_R2  20.84,25.38 0 top
QUARTER_T  14.84,25.38 0 top
QUARTER_U  5.84,25.38 0 top
RED1  12.83,18.44 0 bottom
RED2  9.15,10.03 0 bottom
RED5  6.93,33.28 180 bottom
RED7  13.84,28.98 180 bottom
RESET  11.35,34.18 0 top
SCK  3.97,34.21 0 top
SEVEN(E2)  11.84,7.38 0 top
SEVEN(E)  5.84,7.38 0 top
SEVEN(N)  14.84,7.38 0 top
SEVEN(S)  2.84,7.38 0 top
SEVEN(V)  8.84,7.38 0 top
SEVEN_EXTRA  5.61,21.02 180 top
SIX(I)  14.84,16.38 0 top
SIX(S)  11.84,16.38 0 top
SIX(X)  17.84,16.38 0 top
SIX_EXTRA  3.61,20.98 0 top
TEN(E)  8.84,4.33 0 top
TEN(N)  11.84,4.33 0 top
TEN(T)  5.84,4.31 0 top
TEN_EXTRA  5.61,21.7 0 top
TEN_MIN_E  29.84,25.38 0 top
TEN_MIN_EXTRA  24.8,1.32 180 bottom
TEN_MIN_N  32.84,25.38 0 top
TEN_MIN_T  26.84,25.38 0 top
THREE(E2)  32.84,16.38 0 top
THREE(E)  29.84,16.38 0 top
THREE(H)  23.75,16.39 0 top
THREE(R)  26.84,16.38 0 top
THREE(T)  20.84,16.38 0 top
THREE_EXTRA  2.83,10.39 0 bottom
TO_O  29.84,22.38 0 top
TO_T  26.84,22.38 0 top
TWELVE(E2)  32.84,19.38 0 top
TWELVE(E)  23.84,19.38 0 top
TWELVE(L)  26.84,19.38 0 top
TWELVE(T)  17.84,19.38 0 top
TWELVE(V)  29.84,19.38 0 top
TWELVE(W)  20.84,19.38 0 top
TWENTY_MIN_E  8.84,28.36 0 top
TWENTY_MIN_N  11.84,28.38 0 top
TWENTY_MIN_T1  2.84,28.36 0 top
TWENTY_MIN_T2  14.84,28.38 0 top
TWENTY_MIN_W  5.84,28.38 0 top
TWENTY_MIN_Y  17.84,28.38 0 top
TWO(O)  32.84,13.38 0 top
TWO(T)  26.84,13.38 0 top
TWO(W)  29.84,13.38 0 top
TWO_EXTRA  2.82,7.38 0 bottom
U1  6.67,27.7 90 bottom
U2  21.91,8.66 0 bottom
VCC  29.31,1.45 0 top
Y1  29.13,23.41 180 bottom

### Tracks (layer width: path | path; a pad name or v marks a point on that pad's centre or on a via)
BUTTON  (3 unrouted)
EX_CLCK1
  Bottom 0.406: 26.84,21.72 Y1.4 26.38,22.36 25.38,23.36 25.38,25.56 25.58,25.77 25.96,25.77 26.38,26.19 26.38,26.55 IC3.2
EX_CLCK2  (1 unrouted)
  Bottom 0.406: 28.2,26.28 Y1.1
GND  (via drill 0.35)  (7 unrouted)
  Top 0.406: GND.1 19.1,-0.06 | v21.73,23.21 21.73,23.71 32,23.71 32.01,23.7 | 32.01,23.7 32.04,23.67 | v6.45,26.82 4.24,26.82 v4.06,26.82 | 32.01,23.7 33.49,23.7 v33.58,23.78
  Bottom 0.305: IC3.4 24.23,26.93 24.23,23.04 21.9,23.04 v21.73,23.21
  Bottom 0.406: IC2.2 3.23,20.19 3.29,20.12 | 6.27,20.71 U1.5 | 6.27,20.71 5.54,19.98 3.43,19.98 3.29,20.12 | 6.27,20.71 6.41,20.86 7.9,20.86 7.9,23.38 U1.3 | U2.3 27.56,8.66 30.88,11.97 30.88,26.03 BUTTON.1 33.58,26.56 v33.58,23.78 | U1.21 7.07,27.24 6.6,26.77 6.5,26.77 v6.45,26.82 | v4.06,26.82 4.06,25.17 2.86,23.97 2.37,23.97 1.47,23.06 1.47,20.33 1.68,20.12 3.29,20.12
HOUR1  (via drill 0.35)  (6 unrouted)
  Top 0.152: 8.32,17.36 8.39,17.29 ONE(E).1 | ONE(N).2 6.29,17.36 | FOUR(F).1 2.39,14.02 | 2.39,14.16 2.37,14.18 | 12.29,14.02 FOUR(R).2 | FOUR(U).1 8.39,13.91 8.28,14.02 8.09,14.21 | FOUR(O).2 6.29,14.02 | SEVEN(S).2 3.29,8.01 | SEVEN(V).1 8.48,7.46 8.48,7.85 8.31,8.01 8.18,8.01 | SEVEN(E).1 5.39,7.93 5.48,8.01 | 6.36,5.22 6.29,5.14 TEN(T).2 | 11.37,5.21 11.39,5.18 TEN(N).1 | TEN(E).2 9.29,5.13 9.38,5.22 | TEN_EXTRA.1 4.94,21.92 4.94,23.11 4.94,23.14 | 4.9,23.13 4.91,23.14 | 4.07,23.13 4.06,23.12 ONE_EXTRA.1 | SEVEN_EXTRA.2 TEN_EXTRA.1 | TEN_EXTRA.1 | EIGHT(H).2 11.97,10.7 11.97,10.72 11.84,10.86 8.85,10.86 8.71,10.72 8.71,10.7 EIGHT(G).1 7.21,10.38 6.46,11.13 5.99,11.13
  Top 0.305: ONE(O).2 3.29,17.01 3.64,17.36 | 3.64,17.36 6.29,17.36 8.32,17.36 | 6.29,14.02 2.39,14.02 1.35,14.02 1.31,13.98 | 6.33,14.21 8.09,14.21 | 8.28,14.02 12.29,14.02 | 5.99,11.13 5.23,10.37 EIGHT(E).2 | 8.18,8.01 5.48,8.01 3.29,8.01 1.39,8.01 1.31,7.93 | 1.38,5.22 6.36,5.22 9.38,5.22 11.36,5.22 11.37,5.21 | 3.64,17.36 1.33,17.36 1.31,17.34 1.08,17.1 1.08,21.9 2.31,23.13 4.07,23.13 4.9,23.13 | 3.32,11.13 1.39,11.13 1.31,11.06 | 4.91,23.14 4.94,23.14 | 4.94,23.11 9.56,23.11
  Top 0.406: 1.31,11.06 1.31,5.29 1.38,5.22
  Top 0.813: 1.31,17.34 1.31,13.98 1.31,11.06
  Bottom 0.305: 1.33,11.9 v1.29,11.9
  Bottom 0.406: IC1.12 2.24,13.2 3.22,13.2 3.54,12.88 3.54,12.27 3.17,11.9 1.33,11.9
HOUR2  (via drill 0.35)  (3 unrouted)
  Top 0.152: TWELVE(T).1 17.56,19.55 17.56,20.06 | 27.33,20.06 27.33,19.42 TWELVE(L).2 | TWELVE(E).2 24.29,20.05 24.27,20.06 | TWELVE(W).1 20.39,19.94 20.27,20.06 | SIX(S).1 11.39,17.11 11.53,17.25 | 18.2,17.23 18.29,17.14 SIX(X).2 | SIX(I).1 14.39,17.24 14.4,17.25 | FIVE(F).1 14.39,14.11 14.43,14.14 | FIVE(E).2 24.29,13.93 24.08,14.14 | FIVE(V).1 20.39,14.09 20.45,14.14 | FIVE(I).2 18.33,14.12 18.31,14.14 | EIGHT(T).1 14.39,11.18 14.41,11.2 | 21.18,11.17 21.29,11.06 ELEVEN(L).2 | ELEVEN(E).2 18.33,11.05 18.49,11.2 | SEVEN(E2).1 11.39,8.28 11.44,8.33 | 30.21,8.19 30.29,8.1 NINE(E).2 | NINE(N2).2 27.29,8.17 27.13,8.33 | NINE(I).2 24.29,8.24 24.2,8.33 | NINE(N).2 21.29,8.29 21.24,8.33 | SEVEN(N).1 14.39,8.3 14.42,8.33 | 5.19,3.54 5.19,4.11 TEN(T).1 | 8.17,3.54 8.39,3.76 TEN(E).1 | 12.1,4.97 12.1,4.52 TEN(N).2 11.97,4.01 11.97,3.98 11.54,3.55 v10.72,3.55 | SIX_EXTRA.2 4.06,20.41 | 10.68,17.25 10.68,18.03 10.62,18.09 2.75,18.09 1.81,19.03 1.81,20.34 4.32,20.34 4.38,20.41 | v7.69,1.59 7.69,3.51 7.66,3.54 | 11.59,8.33 9.39,8.33 v9.36,8.3
  Top 0.305: 27.33,20.06 24.27,20.06 20.27,20.06 17.56,20.06 14.48,20.06 14.47,20.05 | 14.57,17.25 14.4,17.25 11.53,17.25 10.73,17.25 10.71,17.22 v10.71,17.09 | 14.57,17.25 18.18,17.25 18.2,17.23 | 14.6,14.14 18.31,14.14 20.45,14.14 24.08,14.14 24.15,14.07 | 14.43,14.14 14.6,14.14 | 21.18,11.17 21.15,11.2 18.49,11.2 14.41,11.2 12.71,11.2 12.48,11.43 9.05,11.43 8.85,11.24 8.69,11.24 8.61,11.16 v8.19,11.16 | 11.44,8.33 11.59,8.33 13.35,8.33 | 13.35,8.33 14.42,8.33 21.24,8.33 24.2,8.33 27.13,8.33 30.06,8.33 30.21,8.19 | 14.46,20.06 14.46,17.35 14.57,17.25 | 10.62,3.45 v10.72,3.55 10.71,3.54 8.17,3.54 7.66,3.54 5.19,3.54 | 10.69,17.25 10.68,17.25 | 14.6,14.14 14.58,14.13 13.56,14.13 13.52,14.09 13.52,12.79 10.96,12.79 v10.79,12.63 10.25,12.63 10.12,12.5 4.38,12.5 v4.32,12.43 | 13.35,7.42 13.35,8.33 | 13.3,4.99 12.13,4.99 12.1,4.97 | 4.06,20.41 4.38,20.41 6.52,20.41
  Bottom 0.152: EXTRA_HOUR1.1 2.71,3.99 2.71,3.97 4.57,2.11 EXTRA_HOUR2.1 5.71,1.79 5.71,1.76 5.88,1.59 v7.69,1.59 | v9.36,8.3 8.58,8.3 EIGHT_EXTRA.1
  Bottom 0.305: 2.81,13.83 2.72,13.92 IC1.13 2.21,13.96 3.39,13.96 4.32,13.03 v4.32,12.43 | v10.71,17.09 11.17,16.63 11.17,13 v10.79,12.63 | v10.79,12.63 10.79,11.97 9.31,11.97 8.8,11.46 8.49,11.46 v8.19,11.16 | 10.22,5.77 11.76,5.77 11.92,5.93 11.92,12.06 11.6,12.39 11.43,12.39 11,12.83 v10.79,12.63 | 10.22,5.77 9.98,5.77 9.98,6.79 9.9,6.88 9.9,7.77 v9.36,8.3 | 10.22,5.77 10.22,4.06 v10.72,3.55
HOUR3  (via drill 0.35)  (3 unrouted)
  Top 0.152: TWELVE(V).1 29.39,20.03 | 29.39,20.03 | 32.39,20.03 TWELVE(E2).1 | 33.14,17.08 33.07,17.15 | THREE(E).2 30.29,17.19 30.23,17.26 | THREE(R).1 26.39,17.25 26.38,17.26 | TWO(T).1 26.39,14.2 26.41,14.22 | 32.4,14.12 TWO(O).1 | TWO(W).2 30.29,14.06 30.45,14.22 | ELEVEN(E2).1 23.39,11.02 23.53,11.17 | 33.19,11.26 33.29,11.16 ELEVEN(N).2 | ELEVEN(E3).2 30.29,11.18 30.21,11.26 | ELEVEN(V).1 26.39,11.21 26.34,11.26 | THREE(H).1 23.3,17.25 23.3,17.26 | THREE(T).2 21.29,17.18 21.37,17.26
  Top 0.305: 29.39,20.03 32.39,20.03 | 21.37,17.26 23.3,17.26 26.38,17.26 30.23,17.26 32.96,17.26 33.07,17.15 | 32.3,14.22 30.45,14.22 26.41,14.22 25.94,14.7 4.43,14.7 v4.16,14.43 | 32.3,14.22 32.4,14.12 | 23.53,11.17 23.63,11.26 26.34,11.26 30.21,11.26 33.19,11.26 | 32.3,14.22 33.14,15.06 33.14,17.08
  Bottom 0.152: TWO_EXTRA.2 2.38,7.39 THREE_EXTRA.2 2.71,10.71 2.71,10.73 4.09,12.12 4.87,12.12 4.93,12.18 4.93,12.96 4.16,13.73 v4.16,14.43
  Bottom 0.305: IC1.14 2.21,14.61 3.99,14.61 v4.16,14.43
HOUR4  (4 unrouted)
  Top 0.152: TWELVE(T).2 18.29,18.78 18.3,18.77 | TWELVE(W).2 21.29,18.74 | TWELVE(E).1 23.39,18.71 | TWELVE(L).1 26.39,18.76 26.44,18.71 26.45,18.7 | TWELVE(V).2 30.29,18.7 | 33.35,18.77 33.35,19.32 TWELVE(E2).2 | THREE(T).1 20.39,18.71 20.36,18.74
  Top 0.305: 18.3,18.77 18.28,18.74 20.36,18.74 21.29,18.74 | 21.37,18.75 23.31,18.75 | 23.39,18.71 26.44,18.71 | 26.45,18.7 30.29,18.7 | 29.96,18.72 33.4,18.72 33.35,18.77
  Bottom 0.152: 2.37,15.03 IC1.15 | IC1.15 2.35,15.04 4.42,15.04 4.77,14.68 4.77,13.55 5.23,13.09 5.23,12.05 4.99,11.82 4.22,11.82 3.75,11.35 3.28,10.88 THREE_EXTRA.1 | IC1.15 1.37,15.22 1.09,15.5
HOUR5  (via drill 0.35)
  Top 0.152: ONE(O).1 2.39,15.68 2.41,15.67 | THREE(E2).1 32.61,16.16 32.61,15.5 | THREE(E).1 29.39,15.54 29.43,15.5 | THREE(R).2 27.29,15.5 | SIX(X).1 17.39,15.59 17.48,15.5 | SIX(I).2 15.29,15.57 15.22,15.5 | SIX(S).2 12.29,15.69 12.11,15.5 | ONE(E).2 9.29,15.52 9.27,15.5 | ONE(N).1 5.39,15.63 5.41,15.61 | 9.98,15.5 9.98,17.66 9.85,17.79 2.63,17.79 1.46,18.95 1.46,20.95 1.49,20.98 SIX_EXTRA.1 ONE_EXTRA.2 | ONE_EXTRA.2 | THREE(H).2 24.2,15.52 24.18,15.5
  Top 0.305: 2.39,15.68 2.54,15.53 4.42,15.53 v4.74,15.85 4.74,15.61 5.41,15.61 | 5.5,15.52 9.29,15.52 | 9.27,15.5 9.98,15.5 12.11,15.5 15.22,15.5 17.48,15.5 24.18,15.5 27.29,15.5 29.43,15.5 32.61,15.5
  Bottom 0.305: IC1.16 4.41,15.87 4.44,15.85 v4.74,15.85
HOUR6  (via drill 0.2, 0.35)  (6 unrouted)
  Top 0.152: 15.35,12.42 17.52,12.42 | 17.52,12.42 21.27,12.42 | 21.27,12.42 23.39,12.42 | 23.39,12.42 27.39,12.42 | 27.39,12.42 29.32,12.42 | 29.32,12.42 33.34,12.42 | 32.9,12.39 33.36,12.39 33.34,12.42 | 32.9,12.39 32.45,11.94 | 32.9,12.39 32.91,12.41 | FIVE(F).2 15.29,12.48 15.35,12.42 | 15.35,12.42 15.44,12.33 | FIVE(I).1 17.52,13.29 17.52,12.42 | FIVE(V).2 21.29,12.44 21.27,12.42 | FIVE(E).1 23.39,12.42 | TWO(T).2 27.29,12.52 27.39,12.42 | TWO(W).1 29.39,12.49 29.32,12.42 | TWO(O).2 33.29,12.47 33.34,12.42 | 5.6,13.17 FOUR(O).1 5.71,13.06 5.71,13.03 5.87,12.88 7.45,12.88 | FOUR(F).2 3.36,13.31 3.36,11.96 | FOUR(R).1 11.39,13.57 11.36,13.6 10.13,13.6 9.91,13.38 FOUR(U).2 8.97,13.06 8.97,13.03 8.84,12.9 7.97,12.9 7.95,12.9 7.81,13.03 7.81,13.06
  Top 0.305: v5.04,11.24 4.66,11.24 3.95,11.96 3.36,11.96 | 32.45,11.94 10.9,11.94 10.89,11.93 4.13,11.93
  Bottom 0.152: 8.14,12.7 8.14,12.4 | 5.61,16.07 5.69,16
  Bottom 0.2: 5.69,16 5.69,11.21 | TWO_EXTRA.1 4.87,8.98 4.87,11.07 5.05,11.25
  Bottom 0.305: IC1.17 2.2,16.56 5.13,16.56 5.61,16.07 | 5.29,11.5 5.05,11.25 v5.04,11.24
  other vias: 7.58,13.57
HOUR7  (via drill 0.35)
  Top 0.152: ELEVEN(N).1 32.39,9.62 32.23,9.46 | EIGHT(E).1 2.39,9.73 | EIGHT(I).2 6.29,10.12 v5.5,9.32 | EIGHT(G).2 9.29,9.38 9.34,9.32 9.37,9.3 | EIGHT(H).1 11.39,9.57 11.66,9.3 | EIGHT(T).2 15.29,9.34 15.25,9.3 | ELEVEN(E).1 17.43,9.53 17.66,9.3 | ELEVEN(L).1 20.39,9.51 20.6,9.3 | ELEVEN(E2).2 24.29,9.31 24.29,9.3 | ELEVEN(V).2 27.29,9.64 27.63,9.3 | ELEVEN(E3).1 29.39,9.47 29.56,9.3
  Top 0.305: 32.23,9.46 32.07,9.3 29.56,9.3 27.63,9.3 24.29,9.3 20.6,9.3 17.66,9.3 15.25,9.3 11.66,9.3 9.37,9.3 | 2.39,9.73 5.09,9.73 v5.5,9.32 9.34,9.32
  Bottom 0.152: v5.5,9.32 5.84,8.99 5.84,6.42 6.72,5.53 7.23,5.53 7.58,5.89 EIGHT_EXTRA.2
  Bottom 0.305: IC1.18 2.2,17.21 5.28,17.21 6.07,16.42 6.07,9.89 v5.5,9.32
HOUR8  (via drill 0.35)  (1 unrouted)
  Top 0.152: SEVEN(S).1 2.39,6.62 2.44,6.57 | NINE(E).1 29.39,6.17 29.36,6.14 | NINE(N2).1 26.39,6.27 26.52,6.14 | NINE(I).1 23.39,6.15 23.4,6.14 | NINE(N).1 20.39,6.28 20.53,6.14 | SEVEN(N).2 15.29,6.32 15.11,6.14 | SEVEN(E2).2 12.29,6.22 12.38,6.14 | SEVEN(V).2 9.29,6.22 9.21,6.14 | SEVEN(E).2 6.29,6.24 6.39,6.14 | SEVEN_EXTRA.1 6.3,20.79 6.68,20.79 6.9,20.56 6.9,20.4 v7.32,19.99 | 15.95,6.07 15.88,6.14 | 15.29,6.09 15.24,6.14 | v9.7,2.25 11.73,2.25 13.9,4.42 13.9,6.08 13.84,6.14
  Top 0.305: 2.44,6.57 2.87,6.14 6.39,6.14 v6.98,6.14 9.21,6.14 12.38,6.14 13.84,6.14 15.11,6.14 15.24,6.14 15.88,6.14 20.53,6.14 23.4,6.14 26.52,6.14 29.36,6.14 30.3,6.14
  Bottom 0.152: EXTRA_HOUR1.2 4.11,4.31 5.97,2.45 5.97,2.43 EXTRA_HOUR2.2 6.43,2.25 v9.7,2.25
  Bottom 0.305: IC1.19 2.2,17.86 5.27,17.86 6.57,16.56 6.57,6.55 v6.98,6.14
INDICATOR1  (3 unrouted)
  Top 0.152: PAST_P.1 2.39,19.64 2.68,19.94 | 5.39,19.94 PAST_A.1 | TO_T.2 27.29,22.8 27.52,23.03 | 30.02,22.96 30.29,22.68 TO_O.2 | OCLOCK_O1.2 18.29,4.74 18.6,5.05 | 26.16,5.08 26.39,4.85 OCLOCK_O2.1 | OCLOCK_L.1 23.39,5.06 23.37,5.08 | OCLOCK_C1.2 21.29,4.85 21.52,5.08
  Top 0.305: 5.39,19.94 2.68,19.94 | 27.52,23.03 29.95,23.03 30.02,22.96 | 18.6,5.05 18.63,5.08 21.52,5.08 23.37,5.08 26.16,5.08
INDICATOR2  (via drill 0.35)  (2 unrouted)
  Top 0.152: PAST_S.2 9.29,19.87 9.47,20.05 | 11.98,20.09 12.29,19.78 PAST_T.2 12.69,19.38 v13.21,19.9 | OCLOCK_O1.1 17.39,3.4 17.57,3.22 | 27.15,3.16 27.29,3.31 OCLOCK_O2.2 | OCLOCK_L.2 24.29,3.2 24.33,3.16 | OCLOCK_C1.1 20.39,3.3 20.26,3.16
  Top 0.305: 9.47,20.05 9.51,20.09 11.98,20.09 | 17.57,3.22 17.62,3.16 20.26,3.16 24.33,3.16 27.15,3.16
  Bottom 0.152: PAST_EXTRA1.1 15.76,23.06 PAST_EXTRA2.1 14.38,19.9 v13.21,19.9
INDICATOR3  (via drill 0.35)  (1 unrouted)
  Top 0.152: PAST_P.2 3.29,18.95 3.53,18.71 | PAST_A.2 6.29,18.52 6.33,18.47 | 8.53,18.47 8.39,18.61 PAST_S.1 8.39,20.15 v8.76,20.52 8.84,20.6 | PAST_T.1 11.39,18.58 11.29,18.47 | TO_T.1 26.62,22.14 26.62,20.6 26.62,20.58 | 28.19,20.58 29.39,21.78 TO_O.1
  Top 0.305: 3.53,18.71 3.77,18.47 6.33,18.47 8.53,18.47 11.29,18.47 | 28.19,20.58 26.62,20.58 | 26.62,20.6 8.84,20.6
  Bottom 0.152: PAST_EXTRA1.2 14.86,23.06 PAST_EXTRA2.2 9.51,21.27 v8.76,20.52
IT_IS_1
  Top 0.152: IT_I.2 3.52,31.15 3.52,30.54 | 14.32,30.42 14.39,30.49 IS_S.1 | 11.3,30.42 11.3,31.29 IS_I.1 | 6.44,30.42 6.29,30.58 IT_T.2
  Top 0.305: 3.52,30.54 3.64,30.42 6.44,30.42 11.3,30.42 14.32,30.42
IT_IS_2
  Top 0.152: IT_I.1 2.39,31.98 2.58,32.17 | 15.13,32.17 15.29,32.01 IS_S.2 | IS_I.2 12.29,31.96 12.08,32.17 | IT_T.1 5.39,32.16 5.4,32.17
  Top 0.305: 2.58,32.17 5.4,32.17 12.08,32.17 15.13,32.17
MIN1  (via drill 0.35)  (2 unrouted)
  Top 0.152: TWENTY_MIN_T1.1 2.39,28.96 2.47,29.04 | 5.27,29.16 5.39,29.03 TWENTY_MIN_W.1 | QUARTER_Q.1 2.39,26.09 2.44,26.14 | 11.98,26.14 12.29,25.83 QUARTER_R1.2 | QUARTER_A.1 8.39,26.07 8.45,26.14 | QUARTER_U.2 6.29,26.08 6.24,26.14 | v22.67,25.28 21.39,25.28 QUARTER_R2.2
  Top 0.305: 2.47,29.04 2.59,29.16 5.27,29.16 | 2.44,26.14 6.24,26.14 v7.64,26.14 8.45,26.14 11.98,26.14
  Bottom 0.152: v7.64,26.14 8.49,26.14 10.23,24.39 16.57,24.39 QUARTER_EXTRA.2 18,22.96 18,22.16 18.09,22.06 20.69,22.06 20.69,24.6 22.67,24.6 v22.67,25.28
MIN2  (via drill 0.35)  (1 unrouted)
  Top 0.152: TWENTY_MIN_E.2 9.29,29.02 9.35,29.08 | 17.38,29.1 17.39,29.1 TWENTY_MIN_Y.1 | TWENTY_MIN_T2.1 14.39,29.01 14.48,29.1 | TWENTY_MIN_N.2 12.29,29.08 12.31,29.1 | QUARTER_T.2 15.37,25.46 15.37,25.99 | QUARTER_E.2 18.29,25.96 18.33,25.99 | TEN_MIN_T.1 26.39,25.98 26.38,25.99 | TEN_MIN_E.1 29.39,25.9 29.3,25.99
  Top 0.305: 9.35,29.08 9.37,29.1 12.31,29.1 14.48,29.1 17.38,29.1 | 15.37,25.99 15.45,25.99 18.33,25.99 26.38,25.99 29.3,25.99 29.44,25.99
  Top 0.406: v13.52,26.48 14.97,26.48 15.45,25.99
  Bottom 0.406: U1.30 13.48,26.5 13.48,26.51 v13.52,26.48
MIN3  (via drill 0.35)  (2 unrouted)
  Top 0.152: HALF(H).2 21.29,32.07 21.41,32.19 | 29.25,32.14 29.39,32 HALF(F).1 | HALF(L).1 26.39,31.94 26.14,32.19 | HALF(A).2 24.29,32.07 24.4,32.19 | FIVE_MIN_F.2 21.29,28.94 21.44,29.09 | 29.41,29.07 29.41,28.39 FIVE_MIN_E.1 | FIVE_MIN_V.1 26.39,29 26.48,29.09 | FIVE_MIN_I.2 24.29,29.02 24.36,29.09 | 29.49,3.69 29.49,4.28 OCLOCK_C2.1 28.9,4.38 27.31,2.78 23.53,2.78 22.38,1.63 v22.38,1.43 | 32.47,3.64 32.47,4.3 OCLOCK_K.1 | 31.02,28.9 31.02,28.98 | 32.36,26.02 32.39,26 TEN_MIN_N.1
  Top 0.305: 21.41,32.19 24.4,32.19 26.14,32.19 29.2,32.19 29.25,32.14 | 21.44,29.09 24.36,29.09 26.48,29.09 29.39,29.09 | 29.39,29.09 29.41,29.07 | 29.49,3.69 29.54,3.64 32.47,3.64 | 29.39,29.09 30.91,29.09 31.02,28.98 | 30.46,26.47 16.39,26.47 15.99,26.86 v15.99,26.9 | 30.46,26.47 31.02,27.03 31.02,28.9 | 30.46,26.47 30.88,26.04 32.35,26.04 32.36,26.02
  Bottom 0.152: TEN_MIN_EXTRA.1 22.48,1.32 v22.38,1.43
  Bottom 0.406: U1.31 11,25.74 13.82,25.74 14.91,26.83 15.93,26.83 v15.99,26.9
MIN4  (via drill 0.35)  (5 unrouted)
  Top 0.152: TWENTY_MIN_T1.2 3.28,27.66 | 6.12,27.66 6.29,27.83 TWENTY_MIN_W.2 | TWENTY_MIN_E.1 8.44,28.31 8.44,27.66 | TWENTY_MIN_N.1 11.42,28.35 11.42,27.66 | TWENTY_MIN_T2.2 15.4,28.27 15.4,27.79 | TWENTY_MIN_Y.2 18.29,27.79 | 20.39,27.78 FIVE_MIN_F.1 | FIVE_MIN_I.1 23.39,27.78 | 23.39,27.72 23.45,27.66 | FIVE_MIN_V.2 27.29,27.91 27.54,27.66 | FIVE_MIN_E.2 30.29,27.73 30.36,27.66 | HALF(H).1 20.39,30.96 20.58,30.77 | 30.06,30.68 30.29,30.91 HALF(F).2 | HALF(L).2 27.29,30.74 27.35,30.68 | HALF(A).1 23.39,30.78 23.29,30.68 | QUARTER_R2.1 19.58,25.38 v19.51,25.31
  Top 0.305: 3.28,27.66 6.12,27.66 8.44,27.66 11.42,27.66 15.4,27.66 | 15.4,27.79 18.29,27.79 | 18.58,27.79 20.52,27.79 | 20.39,27.78 v22.36,27.78 23.39,27.78 | 23.45,27.66 27.54,27.66 30.36,27.66 | 20.58,30.77 20.67,30.68 23.29,30.68 27.35,30.68 30.06,30.68
  Top 0.406: v18.27,27.15 18.58,27.45 18.58,27.79
  Bottom 0.152: v19.51,25.31 21.98,27.78 v22.36,27.78 | 16.25,26.12 16.54,26.12 18.09,24.56 18.79,24.56 18.79,23.09 QUARTER_EXTRA.1
  Bottom 0.406: U1.32 11.12,25.07 15.2,25.07 16.25,26.12 17.28,27.15 v18.27,27.15
MIN6  (via drill 0.35)  (2 unrouted)
  Top 0.152: QUARTER_Q.2 3.29,24.86 3.53,24.63 | QUARTER_U.1 5.39,24.71 5.5,24.6 | QUARTER_A.2 9.29,24.76 9.45,24.6 | QUARTER_R1.1 11.39,24.95 11.74,24.6 | QUARTER_T.1 14.39,24.91 14.7,24.6 | QUARTER_E.1 17.39,24.99 17.78,24.6 | OCLOCK_C2.2 30.29,5.13 30.3,5.13 | 33.1,5.13 33.29,4.94 OCLOCK_K.2 33.29,3.92 33.21,3.84 33.2,3.84 32.62,3.26 28.48,3.26 v26.58,1.36 | TEN_MIN_T.2 27.32,25.35 27.32,24.6 | 33.44,24.61 33.44,25.23 TEN_MIN_N.2 | TEN_MIN_E.2 | TEN_MIN_E.2 30.29,24.6
  Top 0.305: 3.53,24.63 3.55,24.6 5.5,24.6 9.45,24.6 11.74,24.6 14.7,24.6 17.78,24.6 27.32,24.6 30.29,24.6 31.78,24.6 | 30.3,5.13 33.1,5.13 | 31.78,24.61 31.78,24.6 | 31.78,24.6 33.44,24.6 33.44,24.61
  Bottom 0.152: v26.58,1.36 25.29,1.36 TEN_MIN_EXTRA.2
MISO  (1 unrouted)
MOSI  (1 unrouted)
N$1  (1 unrouted)
N$42  (1 unrouted)
RESET  (2 unrouted)
SCK  (1 unrouted)
SCL_TO_SLAVE  (1 unrouted)
  Bottom 0.406: IC3.6 25.57,32.1 21.41,27.93 10K.2
SDA_FROM_UC
  Bottom 0.406: U1.27 13.21,28.9 RED7.1
SDA_TO_SLAVE  (1 unrouted)
  Bottom 0.406: RED7.2 20.82,28.98 IC3.5
SLC_FROM_UC
  Bottom 0.406: U1.28 13.12,28.1 10K.1
VCC  (7 unrouted)
  Bottom 0.305: IC1.20 2.2,18.51 5.27,18.51 | 7.07,9.33 10.26,9.33 U2.1
  Bottom 0.406: U1.4 7.07,24.76 7,24.83 5.55,24.83 5.41,24.69 | 5.41,24.69 5.41,23.47 U1.6 | IC3.8 28.11,30.05 25.57,27.51 IC3.3 | 5.41,24.69 5.02,25.08 5.02,30.87 4.67,31.22 U1.18 | U2.2 32.9,5.03 VCC.1
XTAL1
  Bottom 0.406: IC2.1 4.43,22.45 4.67,22.69 U1.7
XTAL2
  Bottom 0.406: IC2.3 2.03,22.83 2.61,23.41 U1.8

### Text on the board
tNames: IT | IS | HALF | TWENTY | FIVE | QUARTER | TEN | TO | TWELVE | past | ONE | SIX | THREE | FOUR | TWO | FIVE | EIGHT | ELEVEN | SEVEN | NINE | TEN | OCLOCK
bNames: R | SCK | MI | V | G | MO